# Altium project Whitespace_Daughtercard_r4.PrjPcb (part 1 of 2)
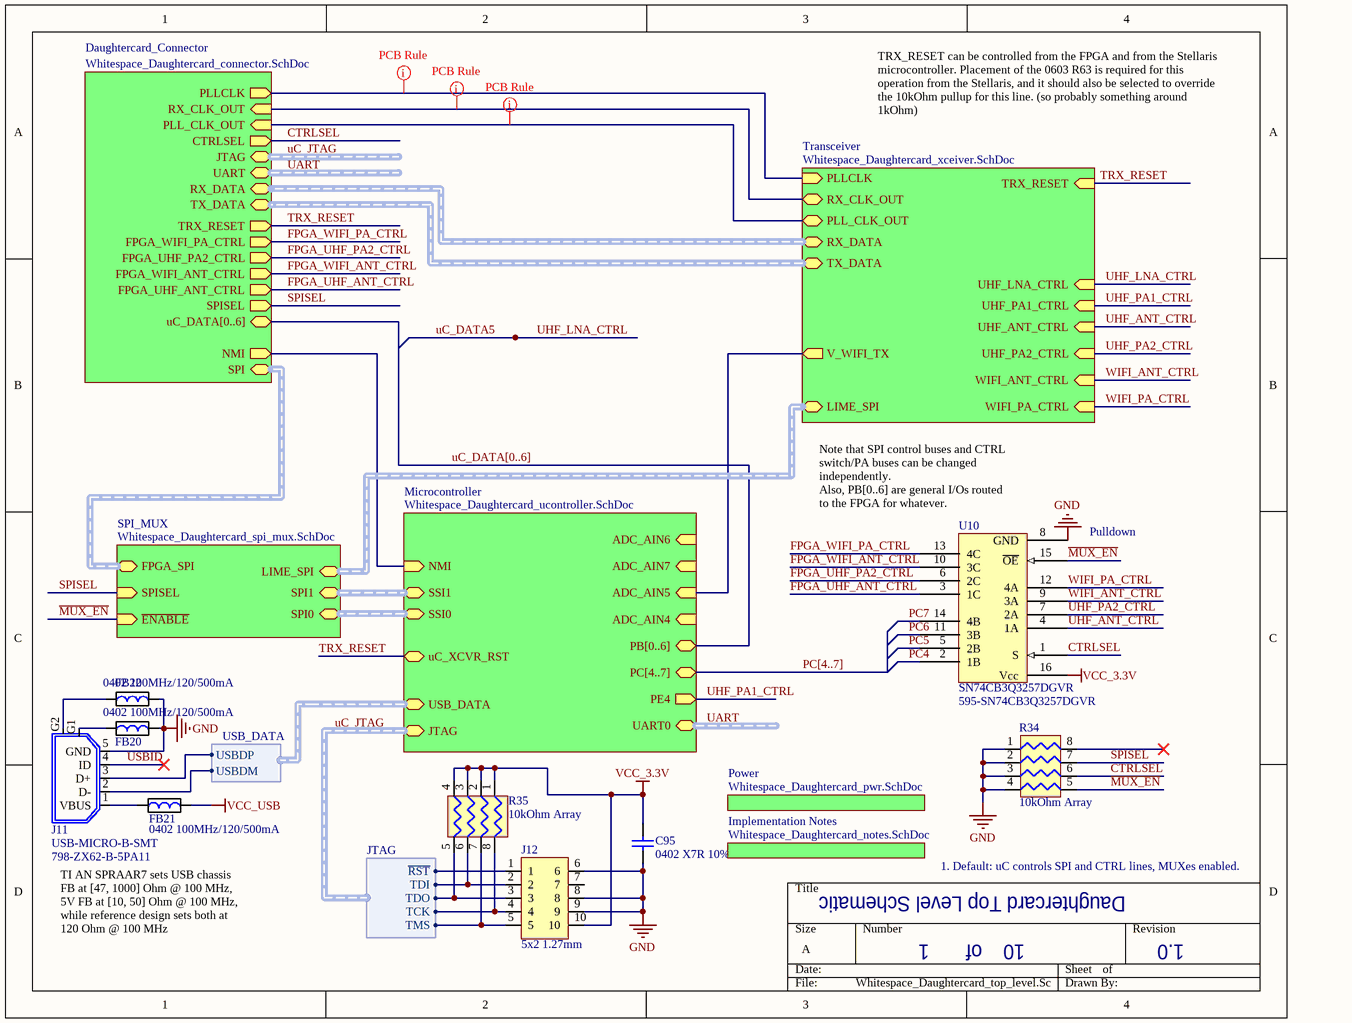
[diagram p0: Whitespace_Daughtercard_top_level.SchDoc]
9 sheets, 355 parts. Net scope: hierarchical (ports join the sheet entries above them; power ports are global).
Board file: Whitespace_Daughtercard.PcbDoc
Sheets:
  Whitespace_Daughtercard_top_level.SchDoc
    Daughtercard_Connector = Whitespace_Daughtercard_connector.SchDoc
    Power = Whitespace_Daughtercard_pwr.SchDoc
    Transceiver = Whitespace_Daughtercard_xceiver.SchDoc
      UHF_RF_FRONT_END = Whitespace_Daughtercard_uhf.SchDoc
      WIFI_RF_FRONT_END = Whitespace_Daughtercard_wifi.SchDoc
    Microcontroller = Whitespace_Daughtercard_ucontroller.SchDoc
    SPI_MUX = Whitespace_Daughtercard_spi_mux.SchDoc
    Implementation Notes = Whitespace_Daughtercard_notes.SchDoc

## Sheet Whitespace_Daughtercard_top_level.SchDoc: Daughtercard Top Level Schematic
size A; Author: Ryan E. Guerra; Revision: 1.0; SheetNumber: 1; SheetTotal: 10

### Parts
C95  0402 X7R 10%  [0402_SMT_V3]
FB20  0402 100MHz/120/500mA  [0402_SMT_v3]
FB21  0402 100MHz/120/500mA  [0402_SMT_v3]
FB22  0402 100MHz/120/500mA  [0402_SMT_v3]
J11  USB-MICRO-B-SMT  Supplier Part Number 1: 798-ZX62-B-5PA11  [USB_MICROB_SMT_R3]
J12  5x2 1.27mm  [1.27mm_2x5_SMT_HDR]
R34  10kOhm Array  [741X083_ChipArray_0402x4_v2]
R35  10kOhm Array  [741X083_ChipArray_0402x4_v2]
U10  SN74CB3Q3257DGVR  Supplier Part Number 1: 595-SN74CB3Q3257DGVR  [TVSOP16_v5]

### Sub-sheets
Daughtercard_Connector = Whitespace_Daughtercard_connector.SchDoc: NMI (out), uC_DATA[0..6], SPISEL (out), FPGA_UHF_ANT_CTRL (out), FPGA_WIFI_ANT_CTRL (out), FPGA_UHF_PA2_CTRL (out), FPGA_WIFI_PA_CTRL (out), SPI (harness SSI), JTAG (harness JTAG), RX_DATA (harness RX_DIG_DATA), TX_DATA (harness TX_DIG_DATA), UART (harness UART), TRX_RESET (out), RX_CLK_OUT (in), PLL_CLK_OUT (in), PLLCLK (out), CTRLSEL (out)
Implementation Notes = Whitespace_Daughtercard_notes.SchDoc: no entries
Microcontroller = Whitespace_Daughtercard_ucontroller.SchDoc: SSI0 (harness SSI), USB_DATA (harness USB_DATA), UART0 (harness UART), NMI (in), JTAG (harness JTAG), PB[0..6], PC[4..7], SSI1 (harness SSI), ADC_AIN6 (in), ADC_AIN7 (in), ADC_AIN5 (in), ADC_AIN4 (in), PE4 (out), uC_XCVR_RST
Power = Whitespace_Daughtercard_pwr.SchDoc: no entries
SPI_MUX = Whitespace_Daughtercard_spi_mux.SchDoc: SPI1 (harness SSI), SPI0 (harness SSI), FPGA_SPI (harness SSI), LIME_SPI (harness SSI), ~{ENABLE} (in), SPISEL (in)
Transceiver = Whitespace_Daughtercard_xceiver.SchDoc: V_WIFI_TX (out), RX_DATA (harness RX_DIG_DATA), TX_DATA (harness TX_DIG_DATA), UHF_ANT_CTRL (in), UHF_PA1_CTRL (in), UHF_PA2_CTRL (in), WIFI_ANT_CTRL (in), WIFI_PA_CTRL (in), TRX_RESET (in), PLLCLK (in), LIME_SPI (harness SSI), RX_CLK_OUT, PLL_CLK_OUT, UHF_LNA_CTRL (in)

### Harnesses
USB_DATA: USBDM, USBDP
JTAG: ~{RST}, TCK, TDI, TDO, TMS

### Nets
GND: C95.2 FB20.2 FB22.2 J11.5(GND) J12.6 J12.8 J12.9 R34.1 R34.2 R34.3 R34.4 U10.8(GND)
VCC_3.3V: C95.1 J12.10 R35.1 R35.2 R35.3 R35.4 U10.16(Vcc)
VCC_USB: FB21.2
~{MUX_EN}: R34.5 U10.15(~{OE}) ; sheet SPI_MUX/~{ENABLE}
~{RST}: J12.1 ; sheet Daughtercard_Connector/JTAG.~{RST}
CTRLSEL: R34.6 U10.1(S) ; sheet Daughtercard_Connector/CTRLSEL
FPGA_UHF_ANT_CTRL: U10.3(1C) ; sheet Daughtercard_Connector/FPGA_UHF_ANT_CTRL
FPGA_UHF_PA2_CTRL: U10.6(2C) ; sheet Daughtercard_Connector/FPGA_UHF_PA2_CTRL
FPGA_WIFI_ANT_CTRL: U10.10(3C) ; sheet Daughtercard_Connector/FPGA_WIFI_ANT_CTRL
FPGA_WIFI_PA_CTRL: U10.13(4C) ; sheet Daughtercard_Connector/FPGA_WIFI_PA_CTRL
NMI: sheet Daughtercard_Connector/NMI, sheet Microcontroller/NMI
PC4: U10.2(1B)
PC5: U10.5(2B)
PC6: U10.11(3B)
PC7: U10.14(4B)
PD2: sheet Transceiver/V_WIFI_TX, sheet Microcontroller/ADC_AIN5
PLL_CLK_OUT: sheet Daughtercard_Connector/PLL_CLK_OUT, sheet Transceiver/PLL_CLK_OUT
PLLCLK: sheet Daughtercard_Connector/PLLCLK, sheet Transceiver/PLLCLK
RX_CLK_OUT: sheet Daughtercard_Connector/RX_CLK_OUT, sheet Transceiver/RX_CLK_OUT
SPISEL: R34.7 ; sheet Daughtercard_Connector/SPISEL, sheet SPI_MUX/SPISEL
TCK: J12.4 R35.8 ; sheet Daughtercard_Connector/JTAG.TCK
TDI: J12.2 R35.6 ; sheet Daughtercard_Connector/JTAG.TDI
TDO: J12.3 R35.5 ; sheet Daughtercard_Connector/JTAG.TDO
TMS: J12.5 R35.7 ; sheet Daughtercard_Connector/JTAG.TMS
TRX_RESET: sheet Daughtercard_Connector/TRX_RESET, sheet Transceiver/TRX_RESET, sheet Microcontroller/uC_XCVR_RST
UHF_ANT_CTRL: U10.4(1A) ; sheet Transceiver/UHF_ANT_CTRL
UHF_PA1_CTRL: sheet Transceiver/UHF_PA1_CTRL, sheet Microcontroller/PE4  [project net PE4]
UHF_PA2_CTRL: U10.7(2A) ; sheet Transceiver/UHF_PA2_CTRL
USB0D_N: J11.2(D-) ; sheet Microcontroller/USB_DATA.USBDM
USB0D_P: J11.3(D+) ; sheet Microcontroller/USB_DATA.USBDP
USBID: J11.4(ID)  [project net USBID_1]
WIFI_ANT_CTRL: U10.9(3A) ; sheet Transceiver/WIFI_ANT_CTRL
WIFI_PA_CTRL: U10.12(4A) ; sheet Transceiver/WIFI_PA_CTRL
NetFB20_1: FB20.1 J11.G1(Chassis_Ground)
NetFB21_1: FB21.1 J11.1(VBUS)
NetFB22_1: FB22.1 J11.G2(Chassis_GND)

Not connected (* = marked no-connect by the designer): J12 7; R34 8*

### Buses and harness runs
bus PC[4..7] = sheet Microcontroller/PC[4..7]
bus uC_DATA[0..6] = sheet Daughtercard_Connector/uC_DATA[0..6] = sheet Microcontroller/PB[0..6]
harness sheet Daughtercard_Connector/RX_DATA = sheet Transceiver/RX_DATA
harness sheet Daughtercard_Connector/SPI = sheet SPI_MUX/FPGA_SPI
harness sheet Daughtercard_Connector/TX_DATA = sheet Transceiver/TX_DATA
harness sheet Microcontroller/SSI0 = sheet SPI_MUX/SPI0
harness sheet Microcontroller/SSI1 = sheet SPI_MUX/SPI1
harness sheet SPI_MUX/LIME_SPI = sheet Transceiver/LIME_SPI
harness UART = sheet Daughtercard_Connector/UART
harness UART = sheet Microcontroller/UART0
harness uC_JTAG = sheet Daughtercard_Connector/JTAG
harness uC_JTAG = sheet Microcontroller/JTAG

### Layout directives
rule Impedance Constraint [Min = 49.00    Max = 51.00    ]: PLL_CLK_OUT, PLLCLK, RX_CLK_OUT

### Notes on the sheet
- TRX_RESET can be controlled from the FPGA and from the Stellaris microcontroller. Placement of the 0603 R63 is required for this operation from the Stellaris, and it should also be selected to override the 10kOhm pullup for this line. (so probably something around 1kOhm)
- (near U10) Note that SPI control buses and CTRL switch/PA buses can be changed independently.
  Also, PB[0..6] are general I/Os routed to the FPGA for whatever.
- Pulldown
- 1. Default: uC controls SPI and CTRL lines, MUXes enabled.
- TI AN SPRAAR7 sets USB chassis FB at [47, 1000] Ohm @ 100 MHz, 5V FB at [10, 50] Ohm @ 100 MHz, while reference design sets both at 120 Ohm @ 100 MHz
- of

### Library data of the parts
C95 = Cap: Capacitor; Value: 0.1uF; Published: 8-Jun-2000; LatestRevisionDate: 17-Jul-2002; LatestRevisionNote: Re-released for DXP Platform.; PackageReference: RAD-0.3; Publisher: Altium Limited; PackageDescription: Radial Cap, Thru-Hole; 2 Leads; 0.3 in Pin Spacing; Supplier 1: Mouser; Supplier Part Number 1: 810-C1005X7R1H104K
FB20-FB22 = FERRITE_BEAD: Ferrite Bead, Various Values; Supplier 1: Mouser; Supplier Part Number 1: 81-BLM15AG121SH1D
  FB20 FB22: Value: 0402 100MHz/120/500mA
J11 = USB-MICRO-B-SMT: Molex Micro-USB Type B Connector; Supplier 1: Mouser
J12 = Header_5x2_FinePitch_1.27mm: 5X2 1.27 SMT Header Pins; Supplier 1: Mouser; Supplier Part Number 1: 649-202112100010C4LF
R34 R35 = 741X083103JP: 10kOhm Ohm 4x0402 Resistor Array; Supplier 1: Mouser; Supplier Part Number 1: 774-741X083103JP
U10 = SN74CB3Q3257DGVR: 4-bit MUX/DEMUX 1-of-2  0-5V SIG 3.3V CTRL TVSOP-16; Supplier 1: Mouser

## Sheet Whitespace_Daughtercard_connector.SchDoc: Daughtercard HSMC Connector & Signals
size A2; Author: Ryan E. Guerra; Revision: 1.0; SheetNumber: 3; SheetTotal: 10
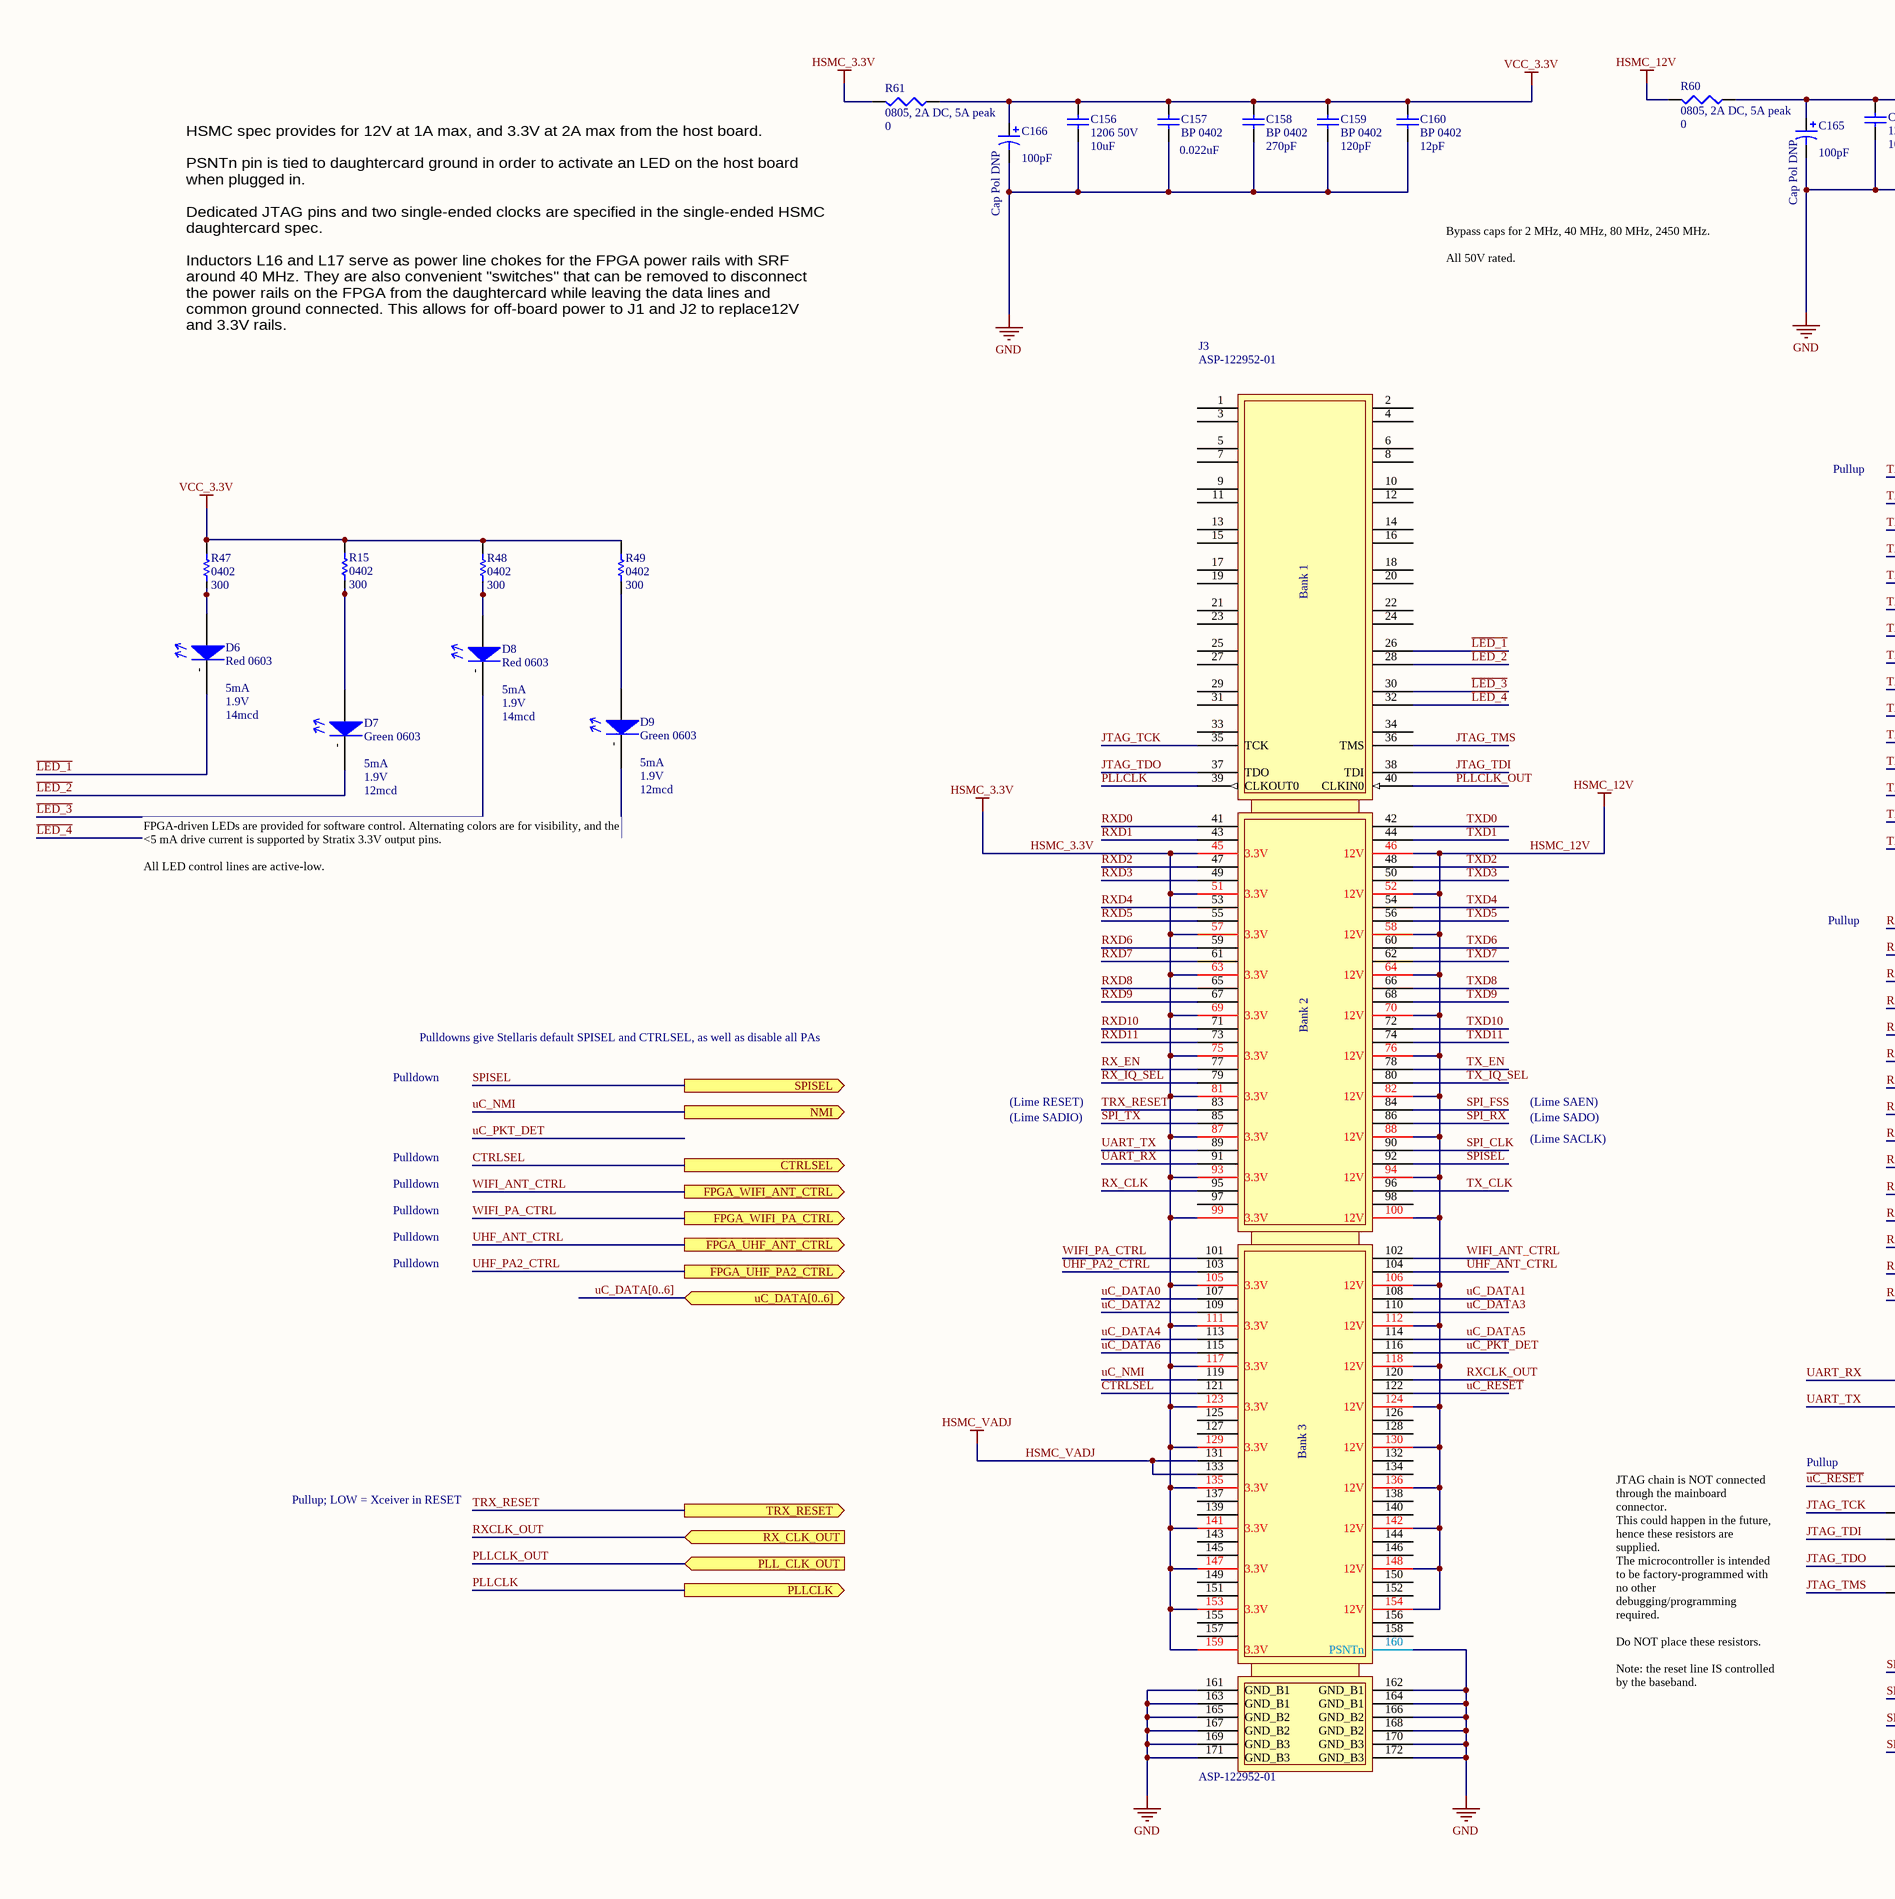
[diagram p1: Whitespace_Daughtercard_connector.SchDoc, left]
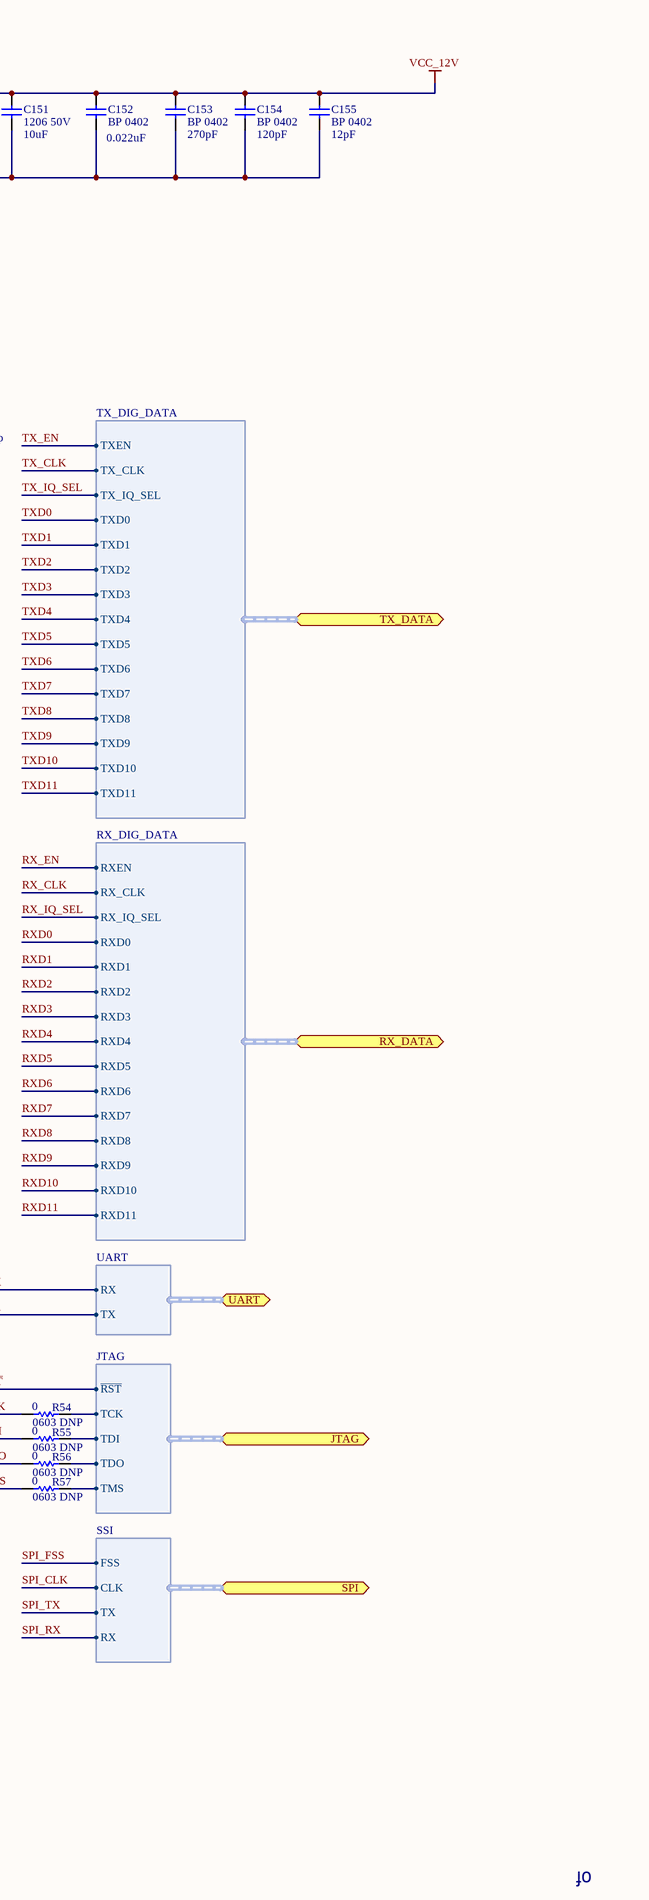
[diagram p2: Whitespace_Daughtercard_connector.SchDoc, right]

### Parts
C151  1206 50V  value 10uF  [1206_SMT_v3]
C152  BP 0402  value 0.022uF  [0402_SMT_V3]
C153  BP 0402  value 270pF  [0402_SMT_v3]
C154  BP 0402  value 120pF  [0402_SMT_v3]
C155  BP 0402  value 12pF  [0402_SMT_v3]
C156  1206 50V  value 10uF  [1206_SMT_v3]
C157  BP 0402  value 0.022uF  [0402_SMT_V3]
C158  BP 0402  value 270pF  [0402_SMT_v3]
C159  BP 0402  value 120pF  [0402_SMT_v3]
C160  BP 0402  value 12pF  [0402_SMT_v3]
C165  Cap Pol DNP  value 100pF  [PANASONIC_ELEC_CAP_G_v2]
C166  Cap Pol DNP  value 100pF  [PANASONIC_ELEC_CAP_G_v2]
D6  Red 0603  Current: 5mA  Forward Voltage Drop: 1.9V  Luminosity: 14mcd  [0603_POLAR]
D7  Green 0603  Current: 5mA  Forward Voltage: 1.9V  Luminosity: 12mcd  [0603_POLAR]
D8  Red 0603  Current: 5mA  Forward Voltage Drop: 1.9V  Luminosity: 14mcd  [0603_POLAR]
D9  Green 0603  Current: 5mA  Forward Voltage: 1.9V  Luminosity: 12mcd  [0603_POLAR]
J3  ASP-122952-01  [ASP-122952-01]
R15  0402  value 300  [0402_SMT_v3]
R47  0402  value 300  [0402_SMT_v3]
R48  0402  value 300  [0402_SMT_v3]
R49  0402  value 300  [0402_SMT_v3]
R54  0603 DNP  value 0  [0603_SMT_v3]
R55  0603 DNP  value 0  [0603_SMT_v3]
R56  0603 DNP  value 0  [0603_SMT_v3]
R57  0603 DNP  value 0  [0603_SMT_v3]
R60  0805, 2A DC, 5A peak  value 0  [0805_SMT_v3]
R61  0805, 2A DC, 5A peak  value 0  [0805_SMT_v3]

### Ports
CTRLSEL (out), FPGA_UHF_ANT_CTRL (out), FPGA_UHF_PA2_CTRL (out), FPGA_WIFI_ANT_CTRL (out), FPGA_WIFI_PA_CTRL (out), JTAG (harness JTAG), NMI (out), PLL_CLK_OUT (in), PLLCLK (out), RX_CLK_OUT (in), RX_DATA (harness RX_DIG_DATA), SPI (harness SSI), SPISEL (out), TRX_RESET (out), TX_DATA (harness TX_DIG_DATA), UART (harness UART), uC_DATA[0..6]

### Harnesses
JTAG: ~{RST}, TCK, TDI, TDO, TMS
RX_DIG_DATA: RXEN, RX_CLK, RX_IQ_SEL, RXD0, RXD1, RXD2, RXD3, RXD4, RXD5, RXD6, RXD7, RXD8, RXD9, RXD10, RXD11
TX_DIG_DATA: TXEN, TX_CLK, TX_IQ_SEL, TXD0, TXD1, TXD2, TXD3, TXD4, TXD5, TXD6, TXD7, TXD8, TXD9, TXD10, TXD11
SSI: FSS, CLK, TX, RX
UART: RX, TX

### Nets
GND: C151.1 C152.1 C153.2 C154.1 C155.2 C156.1 C157.1 C158.2 C159.1 C160.2 C165.2 C166.2 J3.160(PSNTn) J3.161(GND_B1) J3.162(GND_B1) J3.163(GND_B1) J3.164(GND_B1) J3.165(GND_B2) J3.166(GND_B2) J3.167(GND_B2) J3.168(GND_B2) J3.169(GND_B3) J3.170(GND_B3) J3.171(GND_B3) J3.172(GND_B3)
HSMC_3.3V: J3.45(3.3V) J3.51(3.3V) J3.57(3.3V) J3.63(3.3V) J3.69(3.3V) J3.75(3.3V) J3.81(3.3V) J3.87(3.3V) J3.93(3.3V) J3.99(3.3V) J3.105(3.3V) J3.111(3.3V) J3.117(3.3V) J3.123(3.3V) J3.129(3.3V) J3.135(3.3V) J3.141(3.3V) J3.147(3.3V) J3.153(3.3V) J3.159(3.3V) R61.2
HSMC_12V: J3.46(12V) J3.52(12V) J3.58(12V) J3.64(12V) J3.70(12V) J3.76(12V) J3.82(12V) J3.88(12V) J3.94(12V) J3.100(12V) J3.106(12V) J3.112(12V) J3.118(12V) J3.124(12V) J3.130(12V) J3.136(12V) J3.142(12V) J3.148(12V) J3.154(12V) R60.2
HSMC_VADJ: J3.131 J3.133
VCC_3.3V: C156.2 C157.2 C158.1 C159.2 C160.1 C166.1 R15.1 R47.1 R48.1 R49.1 R61.1
VCC_12V: C151.2 C152.2 C153.1 C154.2 C155.1 C165.1 R60.1
~{LED_1}: D6.-(Cathode) J3.26  [project net ~{LED_1_3}]
~{LED_2}: D7.-(Cathode) J3.28  [project net ~{LED_2_3}]
~{LED_3}: D8.-(Cathode) J3.30  [project net ~{LED_3_3}]
~{LED_4}: D9.-(Cathode) J3.32  [project net ~{LED_4_3}]
~{uC_RESET}: J3.122 ; port JTAG.~{RST}  [project net ~{RST}]
CTRLSEL: J3.121 ; port CTRLSEL
JTAG_TCK: J3.35(TCK) R54.2  [project net JTAG_TCK_3]
JTAG_TDI: J3.38(TDI) R55.2  [project net JTAG_TDI_3]
JTAG_TDO: J3.37(TDO) R56.2  [project net JTAG_TDO_3]
JTAG_TMS: J3.36(TMS) R57.2  [project net JTAG_TMS_3]
PLLCLK: J3.39(CLKOUT0) ; port PLLCLK
PLLCLK_OUT: J3.40(CLKIN0) ; port PLL_CLK_OUT  [project net PLL_CLK_OUT]
RX_CLK: J3.95 ; port RX_DATA.RX_CLK
RX_EN: J3.77 ; port RX_DATA.RXEN
RX_IQ_SEL: J3.79 ; port RX_DATA.RX_IQ_SEL
RXCLK_OUT: J3.120 ; port RX_CLK_OUT  [project net RX_CLK_OUT]
RXD0: J3.41 ; port RX_DATA.RXD0
RXD1: J3.43 ; port RX_DATA.RXD1
RXD2: J3.47 ; port RX_DATA.RXD2
RXD3: J3.49 ; port RX_DATA.RXD3
RXD4: J3.53 ; port RX_DATA.RXD4
RXD5: J3.55 ; port RX_DATA.RXD5
RXD6: J3.59 ; port RX_DATA.RXD6
RXD7: J3.61 ; port RX_DATA.RXD7
RXD8: J3.65 ; port RX_DATA.RXD8
RXD9: J3.67 ; port RX_DATA.RXD9
RXD10: J3.71 ; port RX_DATA.RXD10
RXD11: J3.73 ; port RX_DATA.RXD11
SPI_CLK: J3.90 ; port SPI.CLK
SPI_FSS: J3.84 ; port SPI.FSS
SPI_RX: J3.86 ; port SPI.RX
SPI_TX: J3.85 ; port SPI.TX
SPISEL: J3.92 ; port SPISEL
TCK: R54.1 ; port JTAG.TCK
TDI: R55.1 ; port JTAG.TDI
TDO: R56.1 ; port JTAG.TDO
TMS: R57.1 ; port JTAG.TMS
TRX_RESET: J3.83 ; port TRX_RESET
TX_CLK: J3.96 ; port TX_DATA.TX_CLK
TX_EN: J3.78 ; port TX_DATA.TXEN
TX_IQ_SEL: J3.80 ; port TX_DATA.TX_IQ_SEL
TXD0: J3.42 ; port TX_DATA.TXD0
TXD1: J3.44 ; port TX_DATA.TXD1
TXD2: J3.48 ; port TX_DATA.TXD2
TXD3: J3.50 ; port TX_DATA.TXD3
TXD4: J3.54 ; port TX_DATA.TXD4
TXD5: J3.56 ; port TX_DATA.TXD5
TXD6: J3.60 ; port TX_DATA.TXD6
TXD7: J3.62 ; port TX_DATA.TXD7
TXD8: J3.66 ; port TX_DATA.TXD8
TXD9: J3.68 ; port TX_DATA.TXD9
TXD10: J3.72 ; port TX_DATA.TXD10
TXD11: J3.74 ; port TX_DATA.TXD11
UART_RX: J3.91 ; port UART.RX  [project net PA0]
UART_TX: J3.89 ; port UART.TX  [project net PA1]
uC_DATA0: J3.107  [project net PB0]
uC_DATA1: J3.108  [project net PB1]
uC_DATA2: J3.109  [project net PB2]
uC_DATA3: J3.110  [project net PB3]
uC_DATA4: J3.113  [project net PB4]
uC_DATA5: J3.114  [project net PB5]
uC_DATA6: J3.115  [project net PB6]
uC_NMI: J3.119 ; port NMI  [project net NMI]
uC_PKT_DET: J3.116  [project net uC_PKT_DET_3]
UHF_ANT_CTRL: J3.104 ; port FPGA_UHF_ANT_CTRL  [project net FPGA_UHF_ANT_CTRL]
UHF_PA2_CTRL: J3.103 ; port FPGA_UHF_PA2_CTRL  [project net FPGA_UHF_PA2_CTRL]
WIFI_ANT_CTRL: J3.102 ; port FPGA_WIFI_ANT_CTRL  [project net FPGA_WIFI_ANT_CTRL]
WIFI_PA_CTRL: J3.101 ; port FPGA_WIFI_PA_CTRL  [project net FPGA_WIFI_PA_CTRL]
NetD6_+: D6.+(Anode) R47.2
NetD7_+: D7.+(Anode) R15.2
NetD8_+: D8.+(Anode) R48.2
NetD9_+: D9.+(Anode) R49.2

Not connected (* = marked no-connect by the designer): J3 1 2 3 4 5 6 7 8 9 10 11 12 13 14 15 16 17 18 19 20 21 22 23 24 25 27 29 31 33(SDA) 34(SCL) 97 98 125 126 127 128 132 134 137 138 139 140 143 144 145 146 149 150 151 152 155 156 157 158

### Buses and harness runs
bus uC_DATA[0..6] = port uC_DATA[0..6]

### Notes on the sheet
- Bypass caps for 2 MHz, 40 MHz, 80 MHz, 2450 MHz.
  All 50V rated.
- HSMC spec provides for 12V at 1A max, and 3.3V at 2A max from the host board.
  PSNTn pin is tied to daughtercard ground in order to activate an LED on the host board when plugged in.
  Dedicated JTAG pins and two single-ended clocks are specified in the single-ended HSMC daughtercard spec.
  Inductors L16 and L17 serve as power line chokes for the FPGA power rails with SRF around 40 MHz. They are also convenient "switches" that can be removed to disconnect the power rails on the FPGA from the daughtercard while leaving the data lines and common ground connected. This allows for off-board power to J1 and J2 to replace12V and 3.3V rails.
- Pullup
- FPGA-driven LEDs are provided for software control. Alternating colors are for visibility, and the <5 mA drive current is supported by Stratix 3.3V output pins.
  All LED control lines are active-low.
- Pulldowns give Stellaris default SPISEL and CTRLSEL, as well as disable all PAs
- Pulldown
- (Lime RESET)
- (Lime SAEN)
- (Lime SADIO)
- (Lime SADO)
- (Lime SACLK)
- Pullup; LOW = Xceiver in RESET
- JTAG chain is NOT connected through the mainboard connector.
  This could happen in the future, hence these resistors are supplied.
  The microcontroller is intended to be factory-programmed with no other debugging/programming required.
  Do NOT place these resistors.
  Note: the reset line IS controlled by the baseband.
- of
- (in symbol ASP-122952-01) Bank 1; Bank 2; Bank 3

### Library data of the parts
C151-C160 = Cap: Capacitor; Published: 8-Jun-2000; LatestRevisionDate: 17-Jul-2002; LatestRevisionNote: Re-released for DXP Platform.; PackageReference: RAD-0.3; Publisher: Altium Limited; PackageDescription: Radial Cap, Thru-Hole; 2 Leads; 0.3 in Pin Spacing; Supplier 1: Mouser
  C151 C156: Supplier Part Number 1: 81-GRM31CR61H106KA2L
  C152 C157: Supplier Part Number 1: 81-GRM155R71H223KA2J
  C153 C158: Supplier Part Number 1: 81-GRM155C1H271JA01D
  C154 C159: Supplier Part Number 1: 81-GRM1555C1H121GA1D
  C155 C160: Supplier Part Number 1: 81-GRM1555C1H120GA1D
C165 C166 = Cap Pol3: Polarized Capacitor (Surface Mount); Published: 8-Jun-2000; LatestRevisionDate: 29-May-2009; LatestRevisionNote: IPC-7351 Footprint Added.; PackageReference: C0805; Publisher: Altium Limited; PackageDescription: Chip Capacitor; Supplier 1: Mouser; Supplier Part Number 1: 667-EEE-1HA101P
D6-D9 = LED: Supplier 1: Mouser
  D6 D8: Supplier Part Number 1: 859-LTSTC193KRKT5A
  D7 D9: Supplier Part Number 1: 859-LTSTC193KGKT5A
J3 = ASP-122952-01: Samtec HSMC Daughtercard Connector (Male)
R15 R47-R49 R54-R57 = Res Semi: Semiconductor Resistor; Published: 8-Jun-2000; LatestRevisionDate: 17-Jul-2002; LatestRevisionNote: Re-released for DXP Platform.; PackageReference: AXIAL-0.5; Publisher: Altium Limited; PackageDescription: Axial Device, Thru-Hole; 2 Leads; 0.5 in Pin Spacing; Supplier 1: Mouser
  R15 R47-R49: Supplier Part Number 1: 660-RK73B1ETTP301J
  R54-R57: Supplier Part Number 1: 660-RK73Z1JTTDD
R60 R61 = Res3: Resistor; Published: 8-Jun-2000; LatestRevisionDate: 29-May-2009; LatestRevisionNote: IPC-7351 Footprint Added.; PackageReference: J1-0603; Publisher: Altium Limited; PackageDescription: Chip Resistor; Supplier 1: Mouser; Supplier Part Number 1: 660-RK73Z2ATTED

## Sheet Whitespace_Daughtercard_pwr.SchDoc: Daughtercard Power
size A3; DrawnBy: Ryan E. Guerra; Revision: 1.0; SheetNumber: 2; SheetTotal: 10
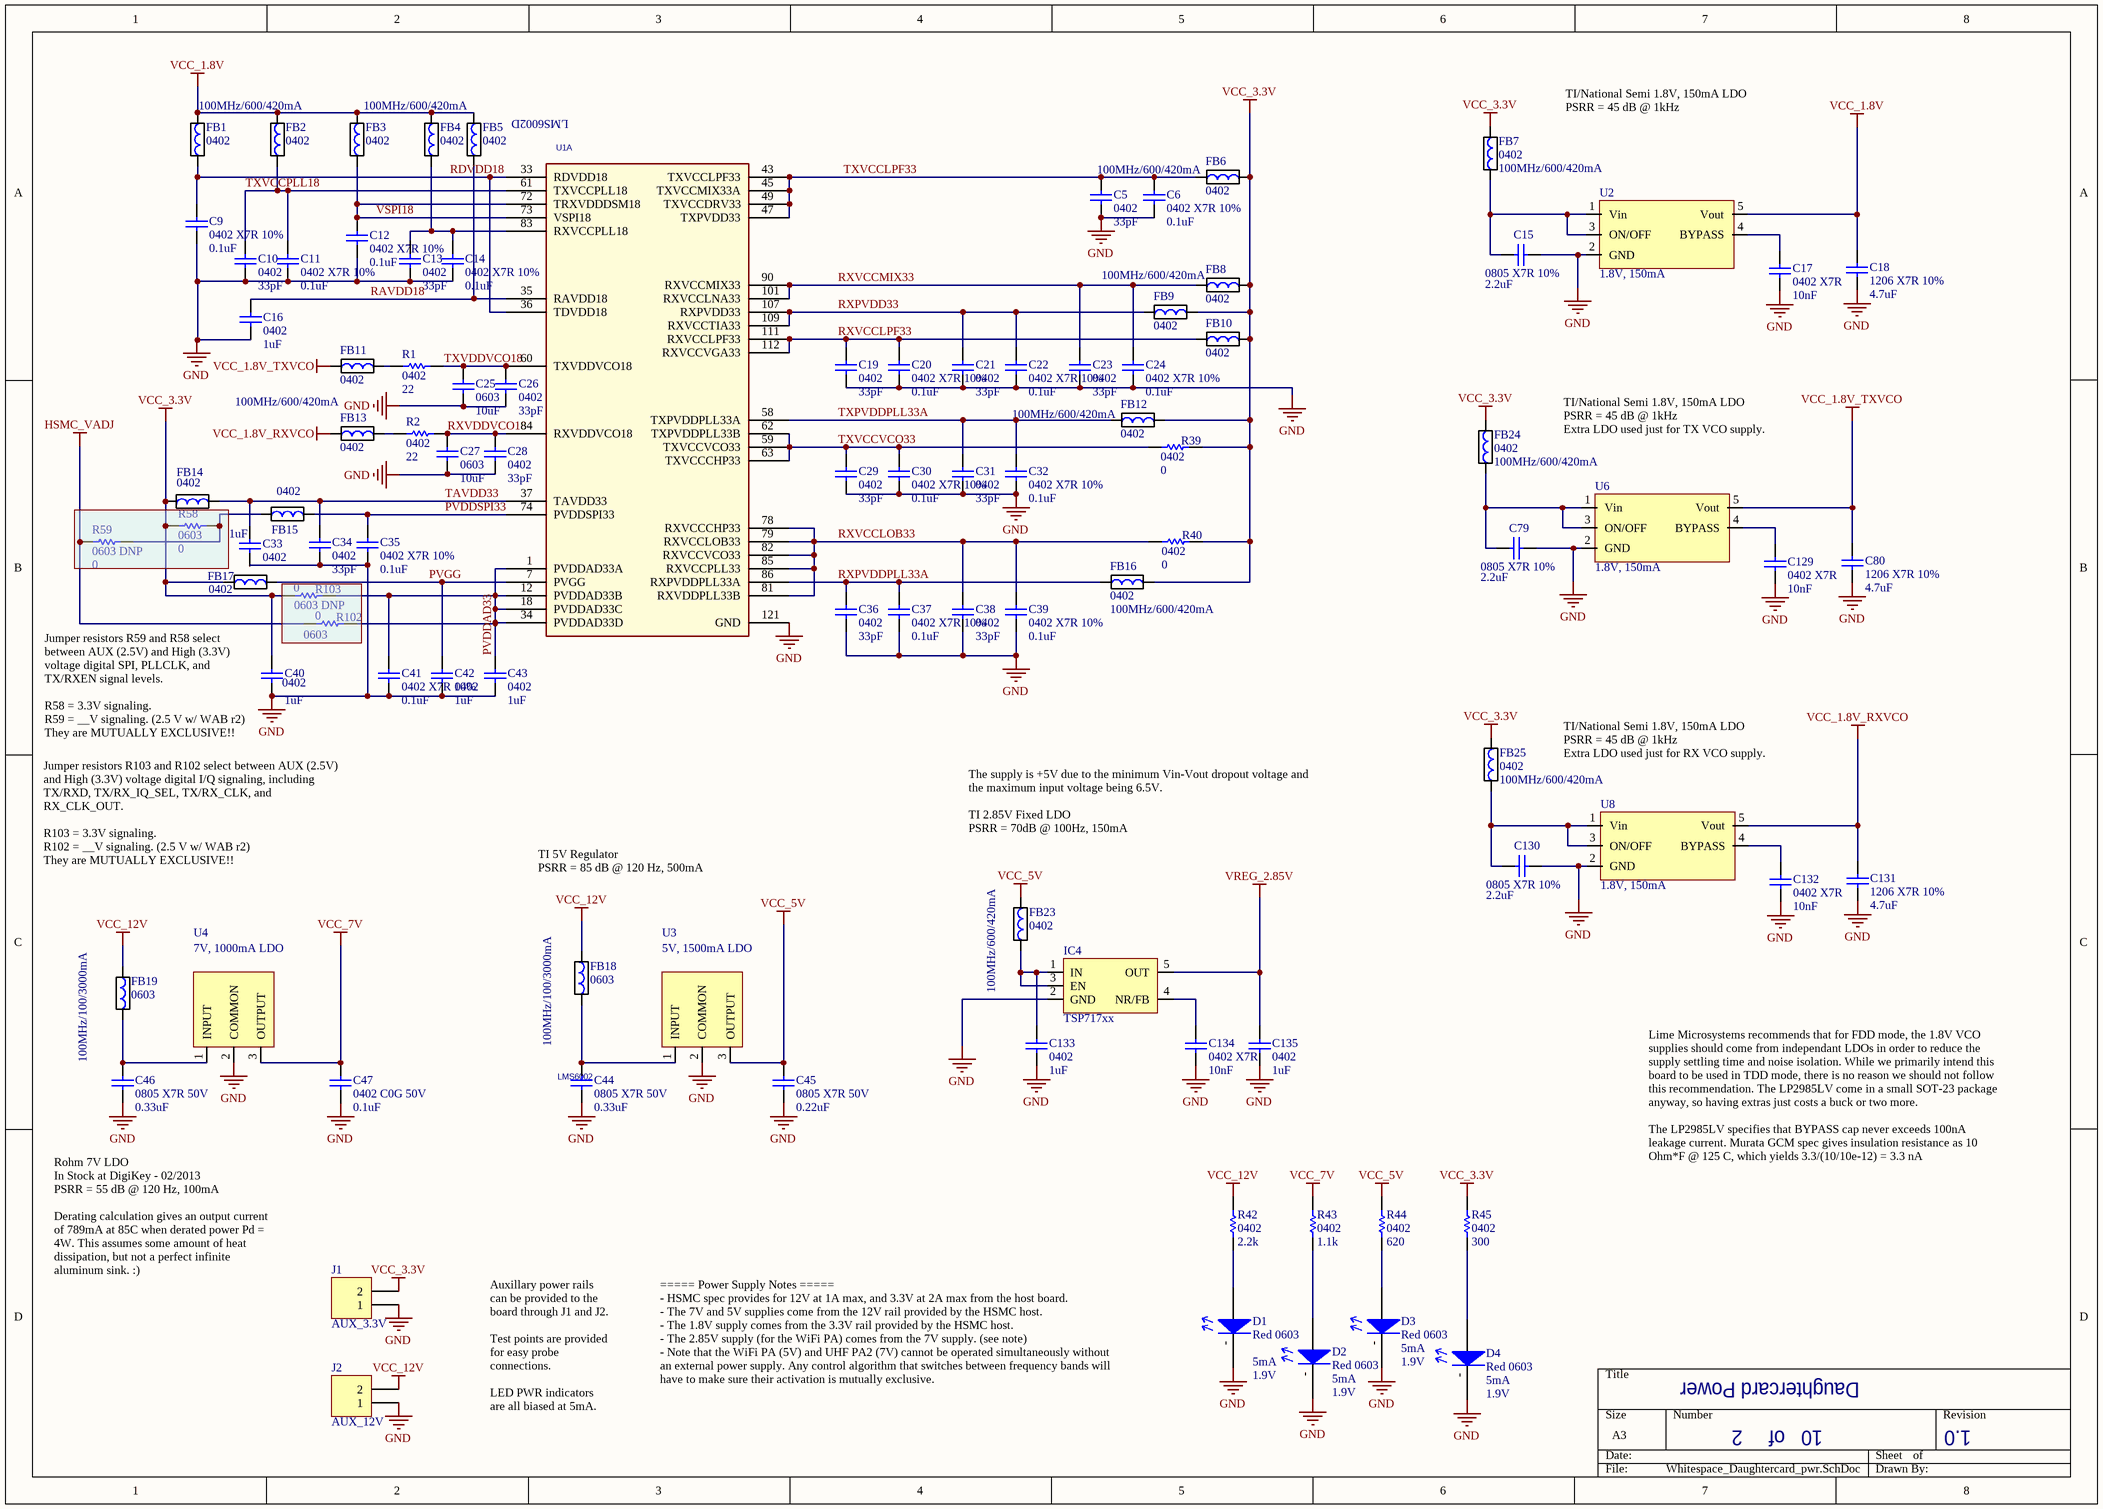
[diagram p3: Whitespace_Daughtercard_pwr.SchDoc]

### Parts
C5  0402  value 33pF  [0402_SMT_v3]
C6  0402 X7R 10%  value 0.1uF  [0402_SMT_v3]
C9  0402 X7R 10%  value 0.1uF  [0402_SMT_v3]
C10  0402  value 33pF  [0402_SMT_v3]
C11  0402 X7R 10%  value 0.1uF  [0402_SMT_v3]
C12  0402 X7R 10%  value 0.1uF  [0402_SMT_v3]
C13  0402  value 33pF  [0402_SMT_v3]
C14  0402 X7R 10%  value 0.1uF  [0402_SMT_v3]
C15  0805 X7R 10%  value 2.2uF  [0805_SMT_v3]
C16  0402  value 1uF  [0402_SMT_v3]
C17  0402 X7R  value 10nF  [0402_SMT_v3]
C18  1206 X7R 10%  value 4.7uF  [1206_SMT_v3]
C19  0402  value 33pF  [0402_SMT_v3]
C20  0402 X7R 10%  value 0.1uF  [0402_SMT_v3]
C21  0402  value 33pF  [0402_SMT_v3]
C22  0402 X7R 10%  value 0.1uF  [0402_SMT_v3]
C23  0402  value 33pF  [0402_SMT_v3]
C24  0402 X7R 10%  value 0.1uF  [0402_SMT_v3]
C25  0603  value 10uF  [0603_SMT_v3]
C26  0402  value 33pF  [0402_SMT_v3]
C27  0603  value 10uF  [0603_SMT_v3]
C28  0402  value 33pF  [0402_SMT_v3]
C29  0402  value 33pF  [0402_SMT_v3]
C30  0402 X7R 10%  value 0.1uF  [0402_SMT_v3]
C31  0402  value 33pF  [0402_SMT_v3]
C32  0402 X7R 10%  value 0.1uF  [0402_SMT_v3]
C33  0402  value 1uF  [0402_SMT_v3]
C34  0402  value 33pF  [0402_SMT_v3]
C35  0402 X7R 10%  value 0.1uF  [0402_SMT_v3]
C36  0402  value 33pF  [0402_SMT_v3]
C37  0402 X7R 10%  value 0.1uF  [0402_SMT_v3]
C38  0402  value 33pF  [0402_SMT_v3]
C39  0402 X7R 10%  value 0.1uF  [0402_SMT_v3]
C40  0402  value 1uF  [0402_SMT_v3]
C41  0402 X7R 10%  value 0.1uF  [0402_SMT_v3]
C42  0402  value 1uF  [0402_SMT_v3]
C43  0402  value 1uF  [0402_SMT_v3]
C44  0805 X7R 50V  value 0.33uF  [0805_SMT_v3]
C45  0805 X7R 50V  value 0.22uF  [0805_SMT_v3]
C46  0805 X7R 50V  value 0.33uF  [0805_SMT_v3]
C47  0402 C0G 50V  value 0.1uF  [0402_SMT_v3]
C79  0805 X7R 10%  value 2.2uF  [0805_SMT_v3]
C80  1206 X7R 10%  value 4.7uF  [1206_SMT_v3]
C129  0402 X7R  value 10nF  [0402_SMT_v3]
C130  0805 X7R 10%  value 2.2uF  [0805_SMT_v3]
C131  1206 X7R 10%  value 4.7uF  [1206_SMT_v3]
C132  0402 X7R  value 10nF  [0402_SMT_v3]
C133  0402  value 1uF  [0402_SMT_v3]
C134  0402 X7R  value 10nF  [0402_SMT_v3]
C135  0402  value 1uF  [0402_SMT_v3]
D1  Red 0603  Current: 5mA  Forward Voltage Drop: 1.9V  [0603_POLAR]
D2  Red 0603  Current: 5mA  Forward Voltage Drop: 1.9V  [0603_POLAR]
D3  Red 0603  Current: 5mA  Forward Voltage Drop: 1.9V  [0603_POLAR]
D4  Red 0603  Current: 5mA  Forward Voltage Drop: 1.9V  [0603_POLAR]
FB1  0402  value 100MHz/600/420mA  [0402_SMT_v3]
FB2  0402  [0402_SMT_v3]
FB3  0402  [0402_SMT_v3]
FB4  0402  [0402_SMT_v3]
FB5  0402  value 100MHz/600/420mA  [0402_SMT_v3]
FB6  0402  value 100MHz/600/420mA  [0402_SMT_v3]
FB7  0402  value 100MHz/600/420mA  [0402_SMT_v3]
FB8  0402  [0402_SMT_v3]
FB9  0402  value 100MHz/600/420mA  [0402_SMT_v3]
FB10  0402  [0402_SMT_v3]
FB11  0402  [0402_SMT_v3]
FB12  0402  value 100MHz/600/420mA  [0402_SMT_v3]
FB13  0402  value 100MHz/600/420mA  [0402_SMT_v3]
FB14  0402  [0402_SMT_v3]
FB15  0402  [0402_SMT_v3]
FB16  0402  value 100MHz/600/420mA  [0402_SMT_v3]
FB17  0402  [0402_SMT_v3]
FB18  0603  value 100MHz/100/3000mA  [0603_SMT_v3]
FB19  0603  value 100MHz/100/3000mA  [0603_SMT_v3]
FB23  0402  value 100MHz/600/420mA  [0402_SMT_v3]
FB24  0402  value 100MHz/600/420mA  [0402_SMT_v3]
FB25  0402  value 100MHz/600/420mA  [0402_SMT_v3]
IC4  TSP717xx  [SC70-5]
J1  AUX_3.3V  [HDR1X2]
J2  AUX_12V  [HDR1X2]
R1  0402  value 22  [0402_SMT_v3]
R2  0402  value 22  [0402_SMT_v3]
R39  0402  value 0  [0402_SMT_v3]
R40  0402  value 0  [0402_SMT_v3]
R42  0402  value 2.2k  [0402_SMT_v3]
R43  0402  value 1.1k  [0402_SMT_v3]
R44  0402  value 620  [0402_SMT_v3]
R45  0402  value 300  [0402_SMT_v3]
R58  0603  value 0  [0603_SMT_v3]
R59  0603 DNP  value 0  [0603_SMT_v3]
R102  0603  value 0  [0603_SMT_v3]
R103  0603 DNP  value 0  [0603_SMT_v3]
U1  LMS6002  [LMS6002D_VIAOFFPAD_v2_Window]  (part A of 4)
U2  1.8V, 150mA  [SOT-23_5Lead]
U3  5V, 1500mA LDO  [TO-263]
U4  7V, 1000mA LDO  [TO252-3]
U6  1.8V, 150mA  [SOT-23_5Lead]
U8  1.8V, 150mA  [SOT-23_5Lead]

### Nets
GND: C5.2 C6.1 C9.1 C10.1 C11.1 C12.1 C13.2 C14.1 C15.1 C16.2 C17.1 C18.1 C19.2 C20.1 C21.2 C22.1 C23.2 C24.1 C25.1 C26.2 C27.1 C28.2 C29.2 C30.1 C31.2 C32.1 C34.1 C35.2 C36.2 C37.1 C38.2 C39.1 C40.1 C41.1 C42.1 C43.1 C44.2 C45.2 C46.2 C47.1 C79.1 C80.1 C129.1 C130.1 C131.1 C132.1 C133.1 C134.1 C135.1 D1.-(Cathode) D2.-(Cathode) D3.-(Cathode) D4.-(Cathode) IC4.2(GND) J1.1 J2.1 U1.121(GND) U2.2(GND) U3.2(COMMON) U4.2(COMMON) U6.2(GND) U8.2(GND)
HSMC_VADJ: R59.1 R102.2
VCC_1.8V: C18.2 FB1.2 FB2.2 FB3.2 FB4.2 FB5.2 U2.5(Vout)
VCC_1.8V_RXVCO: C131.2 FB13.1 U8.5(Vout)
VCC_1.8V_TXVCO: C80.2 FB11.1 U6.5(Vout)
VCC_3.3V: C40.2 FB6.2 FB7.2 FB8.2 FB9.2 FB10.2 FB12.2 FB14.1 FB16.2 FB17.1 FB24.2 FB25.2 J1.2 R39.1 R40.1 R45.2 R58.1 R103.2
VCC_5V: C45.1 FB23.2 R44.2 U3.3(OUTPUT)
VCC_7V: C47.2 R43.2 U4.3(OUTPUT)
VCC_12V: FB18.1 FB19.1 J2.2 R42.2
VREG_2.85V: C135.2 IC4.5(OUT)
PVDDAD33: C41.2 C43.2 R102.1 R103.1 U1.1(PVDDAD33A) U1.12(PVDDAD33B) U1.18(PVDDAD33C) U1.34(PVDDAD33D)  [project net PVDDAD33_2]
PVDDSPI33: C35.1 FB15.2 U1.74(PVDDSPI33)  [project net PVDDSPI33_2]
PVGG: C42.2 FB17.2 U1.7(PVGG)  [project net PVGG_2]
RAVDD18: C16.1 FB5.1 U1.35(RAVDD18)  [project net RAVDD18_2]
RDVDD18: C9.2 FB1.1 U1.33(RDVDD18) U1.36(TDVDD18)  [project net RDVDD18_2]
RXPVDD33: C21.1 C22.2 FB9.1 U1.107(RXPVDD33) U1.109(RXVCCTIA33)  [project net RXPVDD33_2]
RXPVDDPLL33A: C36.1 C37.2 FB16.1 U1.86(RXPVDDPLL33A)  [project net RXPVDDPLL33A_2]
RXVCCLOB33: C38.1 C39.2 R40.2 U1.78(RXVCCCHP33) U1.79(RXVCCLOB33) U1.81(RXVDDPLL33B) U1.82(RXVCCVCO33) U1.85(RXVCCPLL33)  [project net RXVCCLOB33_2]
RXVCCLPF33: C19.1 C20.2 FB10.1 U1.111(RXVCCLPF33) U1.112(RXVCCVGA33)  [project net RXVCCLPF33_2]
RXVCCMIX33: C23.1 C24.2 FB8.1 U1.90(RXVCCMIX33) U1.101(RXVCCLNA33)  [project net RXVCCMIX33_2]
RXVDDVCO18: C27.2 C28.1 R2.1 U1.84(RXVDDVCO18)  [project net RXVDDVCO18_2]
TAVDD33: C33.2 C34.2 FB14.2 U1.37(TAVDD33)  [project net TAVDD33_2]
TXPVDDPLL33A: C31.1 C32.2 FB12.1 U1.58(TXPVDDPLL33A)  [project net TXPVDDPLL33A_2]
TXVCCLPF33: C5.1 C6.2 FB6.1 U1.43(TXVCCLPF33) U1.45(TXVCCMIX33A) U1.47(TXPVDD33) U1.49(TXVCCDRV33)  [project net TXVCCLPF33_2]
TXVCCPLL18: C10.2 C11.2 FB2.1 U1.61(TXVCCPLL18)  [project net TXVCCPLL18_2]
TXVCCVCO33: C29.1 C30.2 R39.2 U1.59(TXVCCVCO33) U1.62(TXPVDDPLL33B) U1.63(TXVCCCHP33)  [project net TXVCCVCO33_2]
TXVDDVCO18: C25.2 C26.1 R1.1 U1.60(TXVDDVCO18)  [project net TXVDDVCO18_2]
VSPI18: C12.2 FB3.1 U1.72(TRXVDDDSM18) U1.73(VSPI18)  [project net VSPI18_2]
NetC13_1: C13.1 C14.2 FB4.1 U1.83(RXVCCPLL18)
NetC15_2: C15.2 FB7.1 U2.1(Vin) U2.3(ON/OFF)
NetC17_2: C17.2 U2.4(BYPASS)
NetC44_1: C44.1 FB18.2 U3.1(INPUT)
NetC46_1: C46.1 FB19.2 U4.1(INPUT)
NetC79_2: C79.2 FB24.1 U6.1(Vin) U6.3(ON/OFF)
NetC129_2: C129.2 U6.4(BYPASS)
NetC130_2: C130.2 FB25.1 U8.1(Vin) U8.3(ON/OFF)
NetC132_2: C132.2 U8.4(BYPASS)
NetC133_2: C133.2 FB23.1 IC4.1(IN) IC4.3(EN)
NetC134_2: C134.2 IC4.4(NR/FB)
NetD1_+: D1.+(Anode) R42.1
NetD2_+: D2.+(Anode) R43.1
NetD3_+: D3.+(Anode) R44.1
NetD4_+: D4.+(Anode) R45.1
NetFB11_2: FB11.2 R1.2
NetFB13_2: FB13.2 R2.2
NetFB15_1: FB15.1 R58.2 R59.2

Not connected (* = marked no-connect by the designer): C33 1

### Notes on the sheet
- TI/National Semi 1.8V, 150mA LDO
  PSRR = 45 dB @ 1kHz
- TI/National Semi 1.8V, 150mA LDO
  PSRR = 45 dB @ 1kHz
  Extra LDO used just for TX VCO supply.
- (near C40) Jumper resistors R59 and R58 select between AUX (2.5V) and High (3.3V) voltage digital SPI, PLLCLK, and TX/RXEN signal levels.
  R58 = 3.3V signaling.
  R59 = __V signaling. (2.5 V w/ WAB r2)
  They are MUTUALLY EXCLUSIVE!!
- TI/National Semi 1.8V, 150mA LDO
  PSRR = 45 dB @ 1kHz
  Extra LDO used just for RX VCO supply.
- (near FB23) The supply is +5V due to the minimum Vin-Vout dropout voltage and the maximum input voltage being 6.5V.
  TI 2.85V Fixed LDO
  PSRR = 70dB @ 100Hz, 150mA
- Jumper resistors R103 and R102 select between AUX (2.5V) and High (3.3V) voltage digital I/Q signaling, including TX/RXD, TX/RX_IQ_SEL, TX/RX_CLK, and RX_CLK_OUT.
  R103 = 3.3V signaling.
  R102 = __V signaling. (2.5 V w/ WAB r2)
  They are MUTUALLY EXCLUSIVE!!
- TI 5V Regulator
  PSRR = 85 dB @ 120 Hz, 500mA
- Lime Microsystems recommends that for FDD mode, the 1.8V VCO supplies should come from independant LDOs in order to reduce the supply settling time and noise isolation. While we primarily intend this board to be used in TDD mode, there is no reason we should not follow this recommendation. The LP2985LV come in a small SOT-23 package anyway, so having extras just costs a buck or two more.
  The LP2985LV specifies that BYPASS cap never exceeds 100nA leakage current. Murata GCM spec gives insulation resistance as 10 Ohm*F @ 125 C, which yields 3.3/(10/10e-12) = 3.3 nA
- Rohm 7V LDO
  In Stock at DigiKey - 02/2013
  PSRR = 55 dB @ 120 Hz, 100mA
  Derating calculation gives an output current of 789mA at 85C when derated power Pd = 4W. This assumes some amount of heat dissipation, but not a perfect infinite aluminum sink. :)
- Auxillary power rails can be provided to the board through J1 and J2.
  Test points are provided for easy probe connections.
  LED PWR indicators are all biased at 5mA.
- of
- (in symbol LMS6002, part A) LMS6002D

### Library data of the parts
C5 C6 C9-C47 C79 C80 C129-C135 = Cap Semi: Capacitor (Semiconductor SIM Model); Published: 8-Jun-2000; LatestRevisionDate: 29-May-2009; LatestRevisionNote: IPC-7351 Footprint Added.; PackageReference: C1206; Publisher: Altium Limited; PackageDescription: Chip Capacitor
  C5 C10 C13 C19 C21 C23 C26 C28 C29 C31 C34 C36 C38: Supplier 1: Mouser; Supplier Part Number 1: 81-GRM1555C1H330JA1D
  C6 C9 C11 C12 C14 C20 C22 C24 C30 C32 C35 C37 C39 C41: Supplier 1: Mouser; Supplier Part Number 1: 810-C1005X7R1H104K
  C15 C79 C130: Supplier 1: Mouser; Supplier Part Number 1: 963-UMK212BB7225KG-T
  C16 C33 C40 C42 C43 C133 C135: Supplier 1: Mouser; Supplier Part Number 1: 810-C1005X5R1E105K
  C17 C129 C132 C134: Supplier 1: Mouser; Supplier Part Number 1: 81-GCM155R71H103KA5D
  C18 C80 C131: Supplier 1: Mouser; Supplier Part Number 1: 963-UMK316AB7475KL-T
  C25 C27: Supplier 1: Mouser; Supplier Part Number 1: 963-EMK107BBJ106MA-T
  C44 C46: Supplier 1: Mouser; Supplier Part Number 1: 81-GRM219R71H334KA88
  C45: Supplier 1: Mouser; Supplier Part Number 1: 81-GRM40X7R224K050AL
  C47: Supplier 1: TDK; Supplier Part Number 1: 810-C1005X7R1H104K
D1-D4 = LED: Supplier 1: Mouser; Supplier Part Number 1: 859-LTSTC193KRKT5A
FB1 FB5-FB7 FB9 FB12 FB13 FB16 FB18 FB19 FB23-FB25 = FERRITE_BEAD: Ferrite Bead, Various Values; Supplier 1: Mouser
  FB1 FB5-FB7 FB9 FB12 FB13 FB16 FB23-FB25: Supplier Part Number 1: 81-BLM15AX601SN1D
  FB18 FB19: Pricing: 1=0.340, 50=0.120, 100=0.066, 500=0.047, 1000=0.035, 4000=0.025, 8000=0.023, 12000=0.022, 20000=0.019 (USD); Supplier Part Number 1: 81-BLM18KG101TN1D
FB2-FB4 FB8 FB10 FB11 FB14 FB15 FB17 = FERRITE_BEAD: Ferrite Bead, Various Values; Value: 100MHz/600/420mA; Supplier 1: Mouser; Supplier Part Number 1: 81-BLM15AX601SN1D
IC4 = TSP717xx: TI LDO Regulator SC70-5 0.9-6.2V; Supplier 1: Mouser; Supplier Part Number 1: 595-TPS717285DCKR
J1 J2 = Header 2: Header, 2-Pin; LatestRevisionDate: 17-Jul-2002; LatestRevisionNote: Re-released for DXP Platform.; Publisher: Altium Limited
R1 R2 R39 R40 R42-R45 R58 R59 R102 R103 = Res Semi: Semiconductor Resistor; Published: 8-Jun-2000; LatestRevisionDate: 17-Jul-2002; LatestRevisionNote: Re-released for DXP Platform.; PackageReference: AXIAL-0.5; Publisher: Altium Limited; PackageDescription: Axial Device, Thru-Hole; 2 Leads; 0.5 in Pin Spacing; Supplier 1: Mouser
  R1 R2: Supplier Part Number 1: 667-ERJ-2GEJ220X
  R39 R40: Supplier Part Number 1: 660-RK73Z1ETTP
  R42: Supplier Part Number 1: 660-RK73B1ETTP222J
  R43: Supplier Part Number 1: 660-RK73B1ETTP112J
  R44: Supplier Part Number 1: 660-RK73B1ETTP621J
  R45: Supplier Part Number 1: 660-RK73B1ETTP301J
  R58 R59 R102 R103: Supplier Part Number 1: 660-RK73Z1JTTDD
U1 = LMS6002: Lime Microsystems Wideband Transceiver Module
U2 U6 U8 = LP2985IM5-1.8: TO LDO 1.8V 150mA Regulator w/ ON/OFF; Supplier 1: Mouser; Supplier Part Number 1: 926-2985IM5-1.8/NOPB
U3 = TL780-05CKTTRG3: TI 5V, 1500mA LDO; Supplier 1: Mouser; Supplier Part Number 1: 595-TL780-05CKTTR
U4 = BA7807FP: ROHM 7V, 1000mA LDO; Supplier 1: Digi-Key; Supplier Part Number 1: BA7807FP-E2DKR-ND

## Sheet Whitespace_Daughtercard_xceiver.SchDoc: RF Transceiver Top Level Design & Signals
size A2; Author: Ryan E. Guerra; Revision: 1.0; SheetNumber: 4; SheetTotal: 10
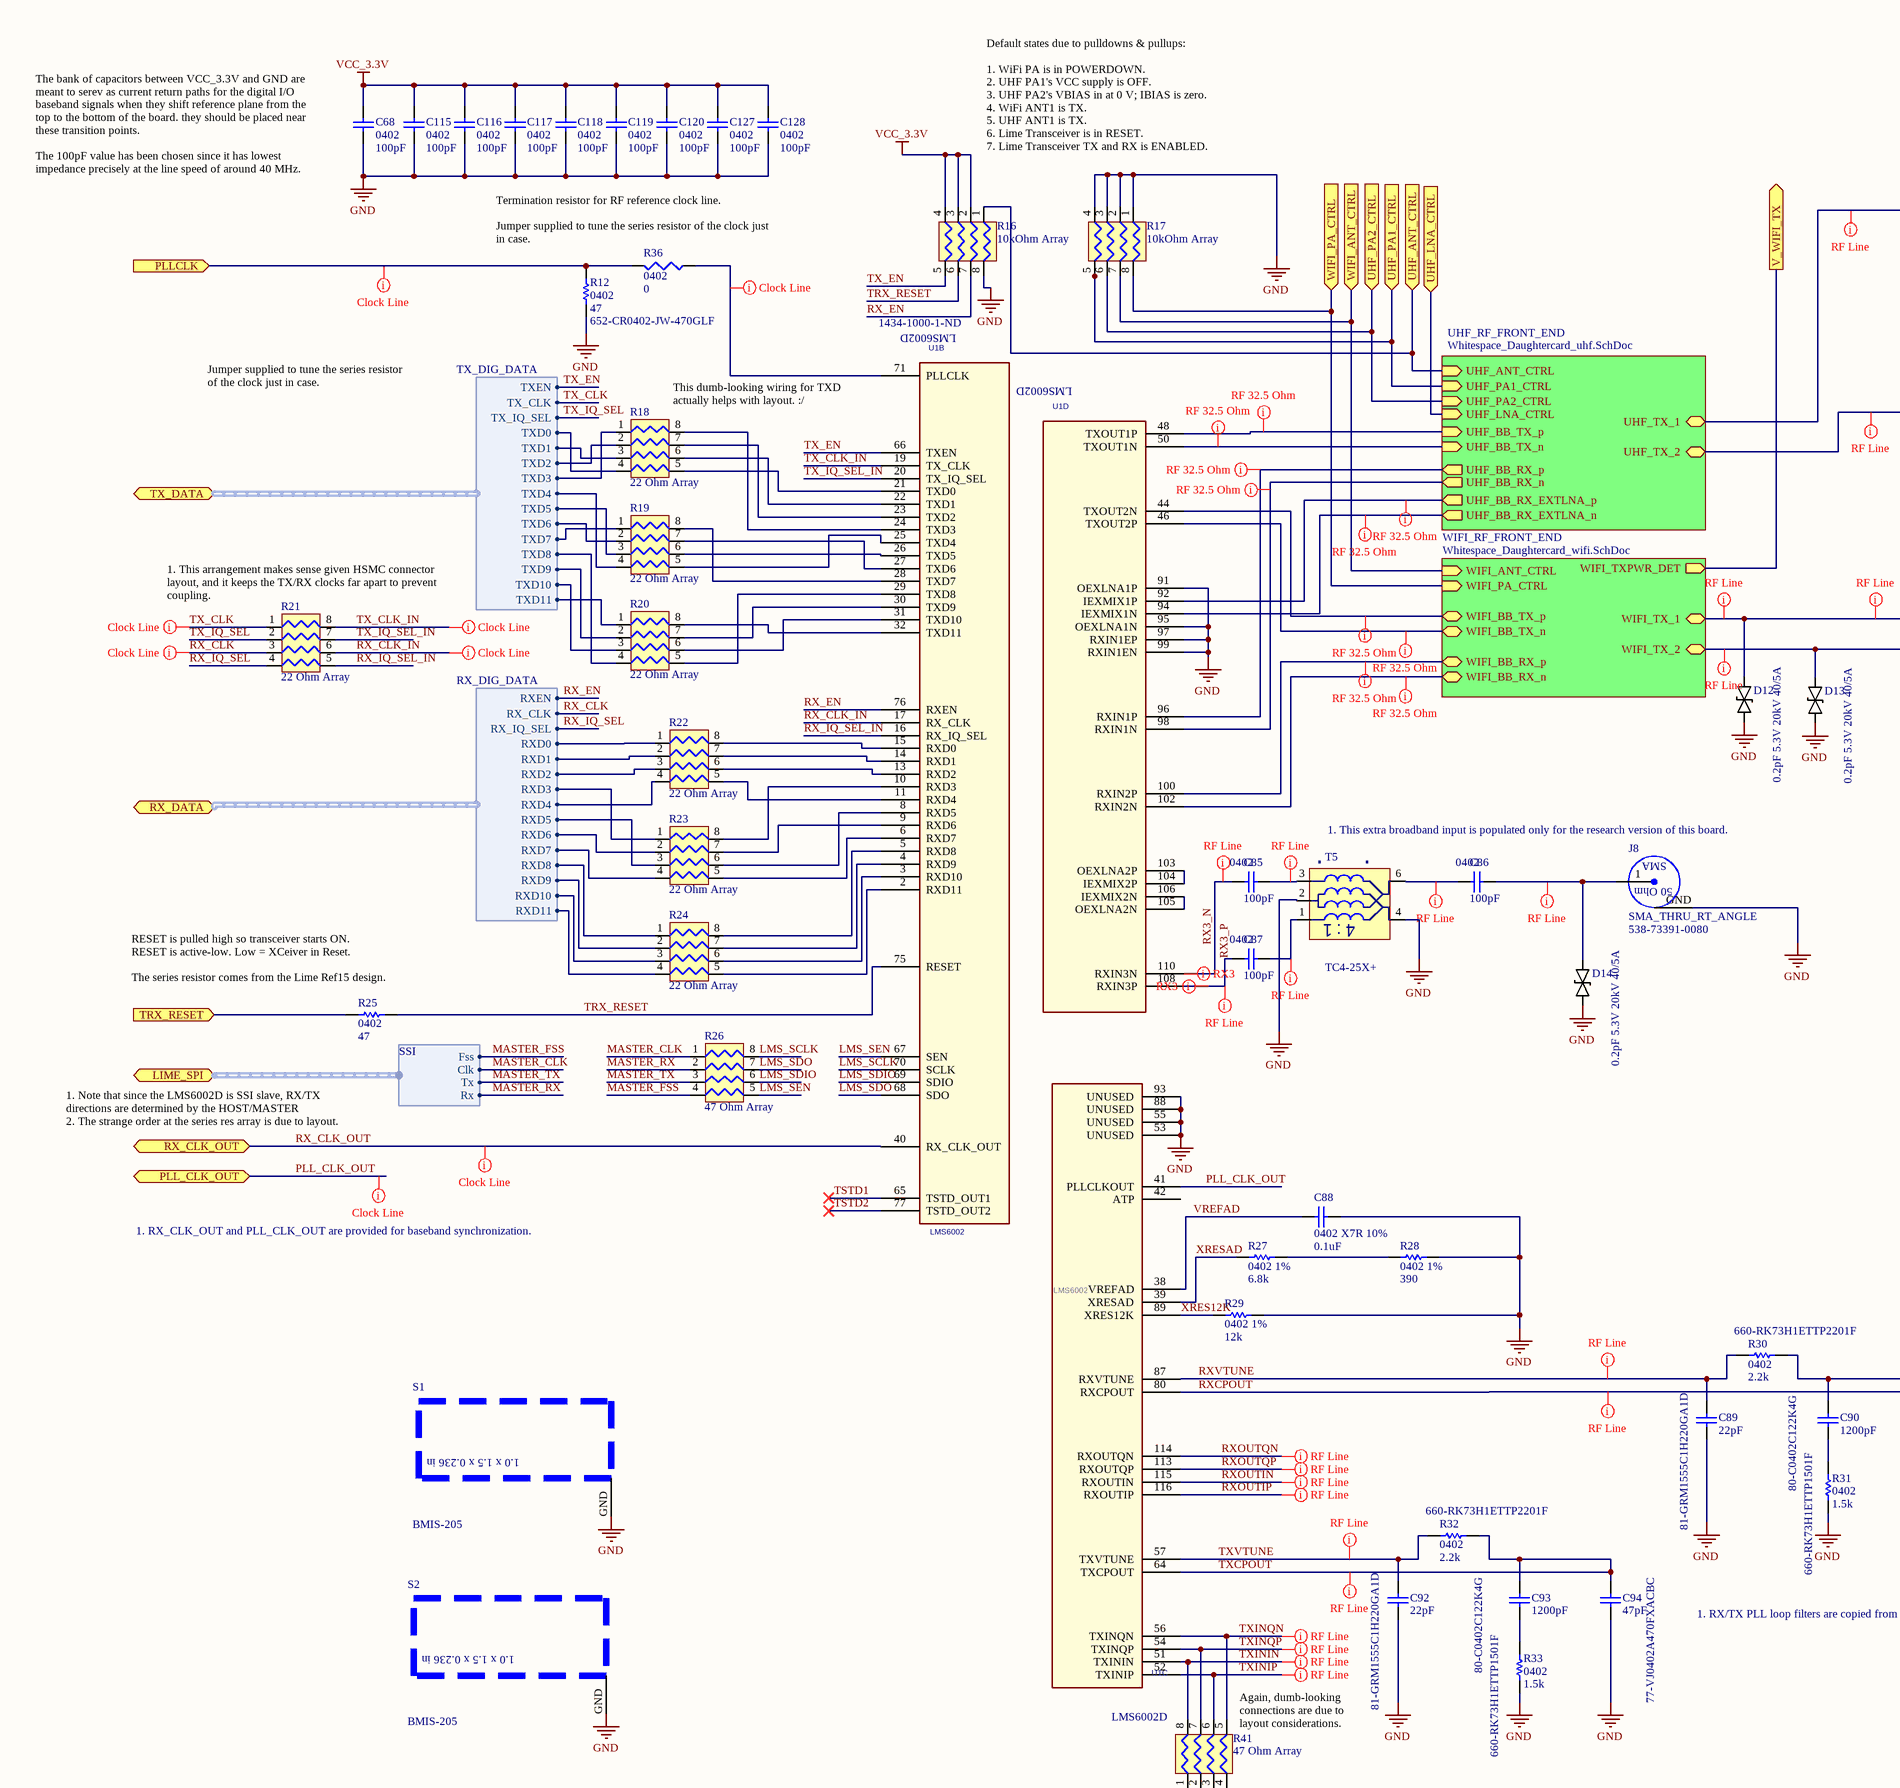
[diagram p4: Whitespace_Daughtercard_xceiver.SchDoc, top left]
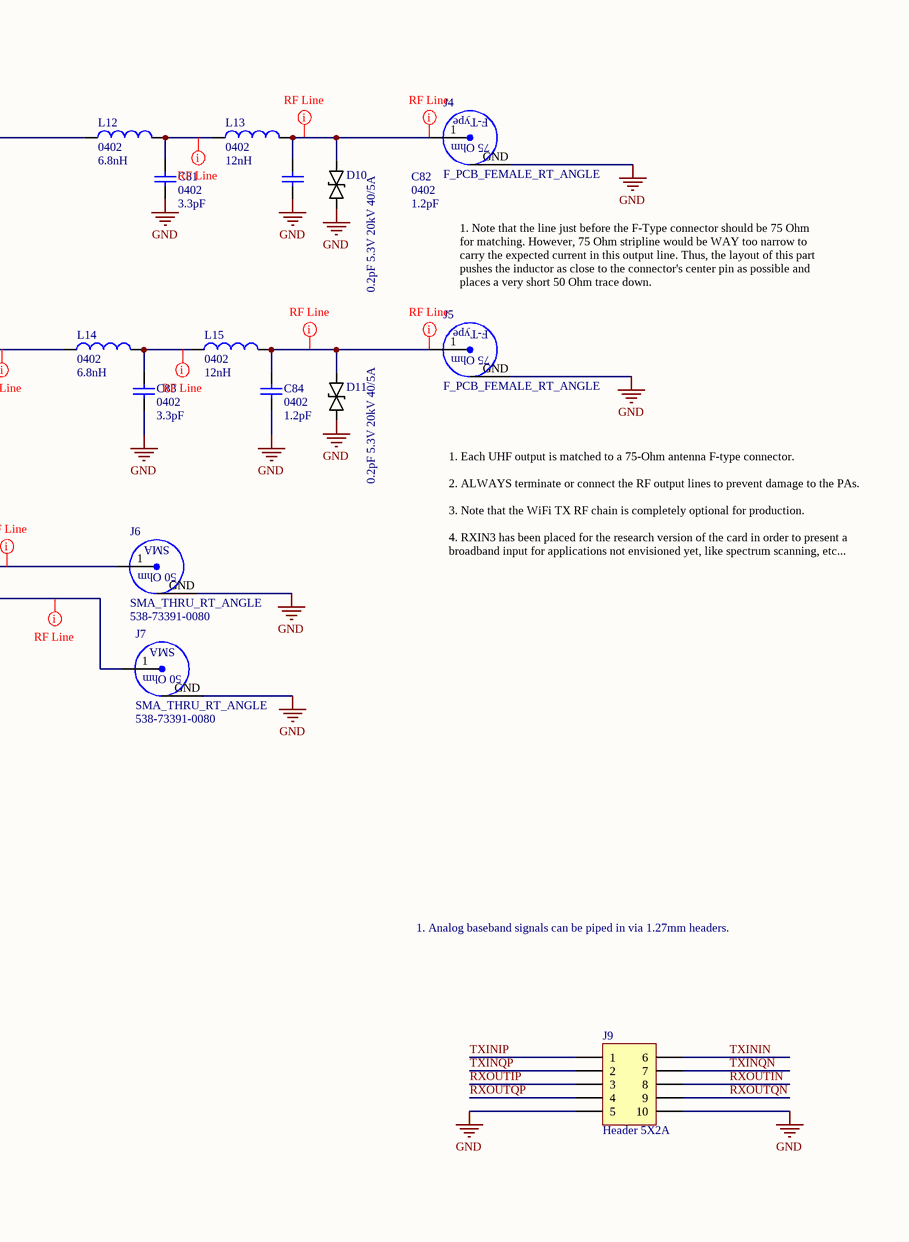
[diagram p5: Whitespace_Daughtercard_xceiver.SchDoc, top right]
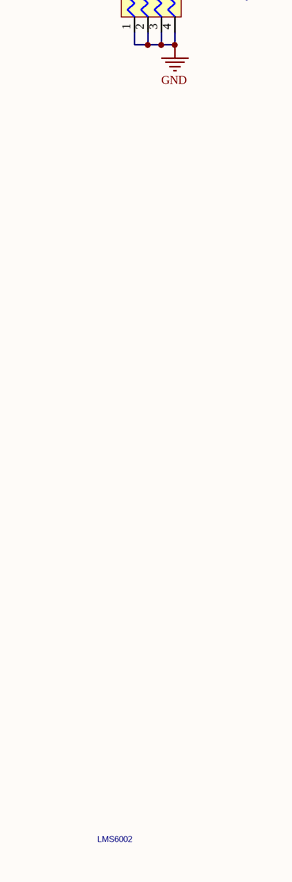
[diagram p6: Whitespace_Daughtercard_xceiver.SchDoc, bottom left]
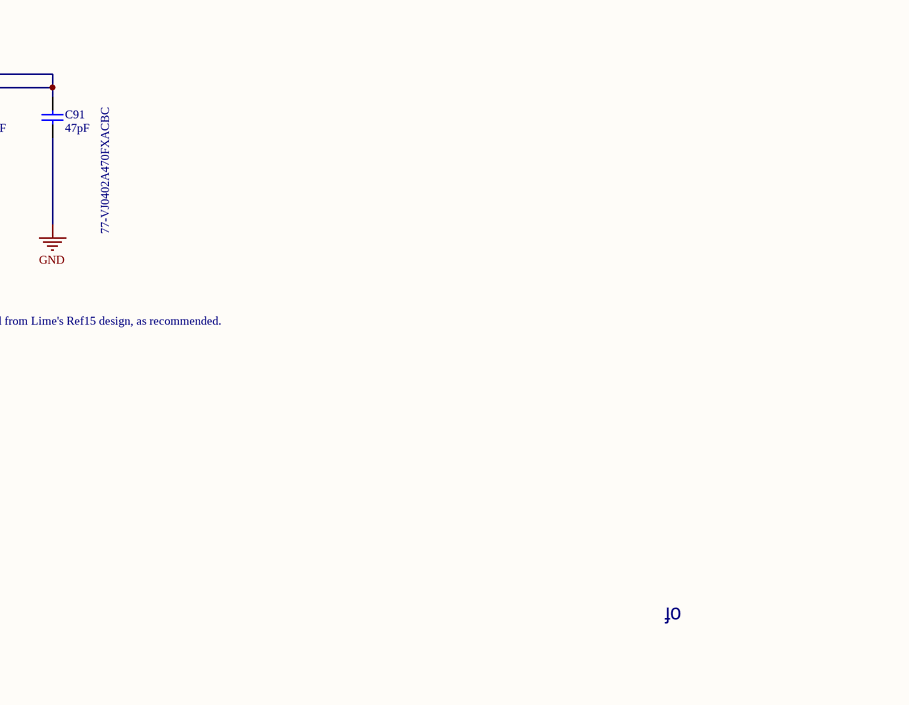
[diagram p7: Whitespace_Daughtercard_xceiver.SchDoc, bottom right]

### Parts
C68  0402  value 100pF  [0402_SMT_v3]
C81  0402  value 3.3pF  [0402_SMT_v3]
C82  0402  value 1.2pF  [0402_SMT_v3]
C83  0402  value 3.3pF  [0402_SMT_v3]
C84  0402  value 1.2pF  [0402_SMT_v3]
C85  0402  value 100pF  [0402_SMT_V3]
C86  0402  value 100pF  [0402_SMT_V3]
C87  0402  value 100pF  [0402_SMT_V3]
C88  0402 X7R 10%  value 0.1uF  [0402_SMT_V3]
C89  value 22pF  Supplier Part Number 1: 81-GRM1555C1H220GA1D  [0402_SMT_v3]  (hidden comment: 0402)
C90  value 1200pF  Supplier Part Number 1: 80-C0402C122K4G  [0402_SMT_v3]  (hidden comment: 0402)
C91  value 47pF  Supplier Part Number 1: 77-VJ0402A470FXACBC  [0402_SMT_v3]  (hidden comment: 0402)
C92  value 22pF  Supplier Part Number 1: 81-GRM1555C1H220GA1D  [0402_SMT_v3]  (hidden comment: 0402)
C93  value 1200pF  Supplier Part Number 1: 80-C0402C122K4G  [0402_SMT_v3]  (hidden comment: 0402)
C94  value 47pF  Supplier Part Number 1: 77-VJ0402A470FXACBC  [0402_SMT_v3]  (hidden comment: 0402)
C115  0402  value 100pF  [0402_SMT_v3]
C116  0402  value 100pF  [0402_SMT_v3]
C117  0402  value 100pF  [0402_SMT_v3]
C118  0402  value 100pF  [0402_SMT_v3]
C119  0402  value 100pF  [0402_SMT_v3]
C120  0402  value 100pF  [0402_SMT_v3]
C127  0402  value 100pF  [0402_SMT_v3]
C128  0402  value 100pF  [0402_SMT_v3]
D10  0.2pF 5.3V 20kV 40/5A  [TSLP-2-17]
D11  0.2pF 5.3V 20kV 40/5A  [TSLP-2-17]
D12  0.2pF 5.3V 20kV 40/5A  [TSLP-2-17]
D13  0.2pF 5.3V 20kV 40/5A  [TSLP-2-17]
D14  0.2pF 5.3V 20kV 40/5A  [TSLP-2-17]
J4  F_PCB_FEMALE_RT_ANGLE  [F_RT_ANGLE_PCB_FEMALE_5-1634540-1]
J5  F_PCB_FEMALE_RT_ANGLE  [F_RT_ANGLE_PCB_FEMALE_5-1634540-1]
J6  SMA_THRU_RT_ANGLE  Supplier Part Number 1: 538-73391-0080  [SMA_PCB_RtAngle_Female_MolexSD-73391-008_v4]
J7  SMA_THRU_RT_ANGLE  Supplier Part Number 1: 538-73391-0080  [SMA_PCB_RtAngle_Female_MolexSD-73391-008_v4]
J8  SMA_THRU_RT_ANGLE  Supplier Part Number 1: 538-73391-0080  [SMA_PCB_RtAngle_Female_MolexSD-73391-008_v4]
J9  Header 5X2A  [HDR2X5_CEN]
L12  0402  value 6.8nH  [0402_SMT_v3]
L13  0402  value 12nH  [0402_SMT_v3]
L14  0402  value 6.8nH  [0402_SMT_v3]
L15  0402  value 12nH  [0402_SMT_v3]
R12  0402  value 47  Supplier Part Number 1: 652-CR0402-JW-470GLF  [0402_SMT_v3]
R16  10kOhm Array  [741X083_ChipArray_0402x4_v2]
R17  10kOhm Array  [741X083_ChipArray_0402x4_v2]
R18  22 Ohm Array  [741X083_ChipArray_0402x4_v2]
R19  22 Ohm Array  [741X083_ChipArray_0402x4_v2]
R20  22 Ohm Array  [741X083_ChipArray_0402x4_v2]
R21  22 Ohm Array  [741X083_ChipArray_0402x4_v2]
R22  22 Ohm Array  [741X083_ChipArray_0402x4_v2]
R23  22 Ohm Array  [741X083_ChipArray_0402x4_v2]
R24  22 Ohm Array  [741X083_ChipArray_0402x4_v2]
R25  0402  value 47  [0402_SMT_v3]
R26  47 Ohm Array  [741X083_ChipArray_0402x4_v2]
R27  0402 1%  value 6.8k  [0402_SMT_v3]
R28  0402 1%  value 390  [0402_SMT_v3]
R29  0402 1%  value 12k  [0402_SMT_v3]
R30  0402  value 2.2k  Supplier Part Number 1: 660-RK73H1ETTP2201F  [0402_SMT_v3]
R31  0402  value 1.5k  Supplier Part Number 1: 660-RK73H1ETTP1501F  [0402_SMT_v3]
R32  0402  value 2.2k  Supplier Part Number 1: 660-RK73H1ETTP2201F  [0402_SMT_v3]
R33  0402  value 1.5k  Supplier Part Number 1: 660-RK73H1ETTP1501F  [0402_SMT_v3]
R36  0402  value 0  [0402_SMT_v3]
R41  47 Ohm Array  [741X083_ChipArray_0402x4_v2]
S1  BMIS-205  [BMIS-205]
S2  BMIS-205  [BMIS-205]
T5  TC4-25X+  [AT224-1_V2]
U1  LMS6002  Supplier Part Number 1: 1434-1000-1-ND  [LMS6002D_VIAOFFPAD_v2_Window]  (parts B,C,D of 4)

### Sub-sheets
UHF_RF_FRONT_END = Whitespace_Daughtercard_uhf.SchDoc: UHF_PA2_CTRL (in), UHF_TX_1 (bidir), UHF_TX_2 (bidir), UHF_ANT_CTRL (in), UHF_PA1_CTRL (in), UHF_BB_TX_p (in), UHF_BB_TX_n (in), UHF_BB_RX_p (out), UHF_BB_RX_n (out), UHF_BB_RX_EXTLNA_p (out), UHF_BB_RX_EXTLNA_n (out), UHF_LNA_CTRL (in)
WIFI_RF_FRONT_END = Whitespace_Daughtercard_wifi.SchDoc: WIFI_TXPWR_DET (out), WIFI_TX_2, WIFI_TX_1, WIFI_BB_TX_p, WIFI_BB_RX_p, WIFI_BB_RX_n, WIFI_BB_TX_n, WIFI_ANT_CTRL (in), WIFI_PA_CTRL (in)

### Ports
LIME_SPI (harness SSI), PLL_CLK_OUT, PLLCLK (in), RX_CLK_OUT, RX_DATA (harness RX_DIG_DATA), TRX_RESET (in), TX_DATA (harness TX_DIG_DATA), UHF_ANT_CTRL (in), UHF_LNA_CTRL (in), UHF_PA1_CTRL (in), UHF_PA2_CTRL (in), V_WIFI_TX (out), WIFI_ANT_CTRL (in), WIFI_PA_CTRL (in)

### Harnesses
TX_DIG_DATA: TXEN, TX_CLK, TX_IQ_SEL, TXD0, TXD1, TXD2, TXD3, TXD4, TXD5, TXD6, TXD7, TXD8, TXD9, TXD10, TXD11
RX_DIG_DATA: RXEN, RX_CLK, RX_IQ_SEL, RXD0, RXD2, RXD3, RXD4, RXD5, RXD6, RXD7, RXD8, RXD9, RXD10, RXD11, RXD1
SSI: Fss, Clk, Tx, Rx

### Nets
GND: C68.2 C81.1 C82.1 C83.1 C84.1 C88.1 C89.1 C91.1 C92.1 C94.1 C115.2 C116.2 C117.2 C118.2 C119.2 C120.2 C127.2 C128.2 D10.1 D11.1 D12.1 D13.1 D14.1 J4.GND J5.GND J6.GND J7.GND J8.GND J9.5 J9.10 R12.1 R16.8 R17.1 R17.2 R17.3 R17.4 R28.1 R29.2 R31.1 R33.1 R41.1 R41.2 R41.3 R41.4 S1.GND S2.GND T5.2(S_CT) T5.4(P) U1.53(UNUSED) U1.55(UNUSED) U1.88(UNUSED) U1.91(OEXLNA1P) U1.93(UNUSED) U1.95(OEXLNA1N) U1.97(RXIN1EP) U1.99(RXIN1EN)
VCC_3.3V: C68.1 C115.1 C116.1 C117.1 C118.1 C119.1 C120.1 C127.1 C128.1 R16.2 R16.3 R16.4
LMS_SCLK: R26.8 U1.70(SCLK)  [project net LMS_SCLK_4]
LMS_SDIO: R26.6 U1.69(SDIO)  [project net LMS_SDIO_4]
LMS_SDO: R26.7 U1.68(SDO)  [project net LMS_SDO_4]
LMS_SEN: R26.5 U1.67(SEN)  [project net LMS_SEN_4]
MASTER_CLK: R26.1 ; port LIME_SPI.Clk
MASTER_FSS: R26.4 ; port LIME_SPI.Fss
MASTER_RX: R26.2 ; port LIME_SPI.Rx
MASTER_TX: R26.3 ; port LIME_SPI.Tx
PB5: port UHF_LNA_CTRL, sheet UHF_RF_FRONT_END/UHF_LNA_CTRL
PD2: port V_WIFI_TX, sheet WIFI_RF_FRONT_END/WIFI_TXPWR_DET
PE4: R17.5 ; port UHF_PA1_CTRL, sheet UHF_RF_FRONT_END/UHF_PA1_CTRL
PLL_CLK_OUT: U1.41(PLLCLKOUT) ; port PLL_CLK_OUT
PLLCLK: R12.2 R36.2 ; port PLLCLK
RX3_N: C85.2 U1.110(RXIN3N)  [project net RX3_N_4]
RX3_P: C87.2 U1.108(RXIN3P)  [project net RX3_P_4]
RX_CLK: R21.3 ; port RX_DATA.RX_CLK
RX_CLK_IN: R21.6 U1.17(RX_CLK)  [project net RX_CLK_IN_4]
RX_CLK_OUT: U1.40(RX_CLK_OUT) ; port RX_CLK_OUT
RX_EN: R16.7 U1.76(RXEN) ; port RX_DATA.RXEN
RX_IQ_SEL: R21.4 ; port RX_DATA.RX_IQ_SEL
RX_IQ_SEL_IN: R21.5 U1.16(RX_IQ_SEL)  [project net RX_IQ_SEL_IN_4]
RXCPOUT: C90.2 C91.2 R30.2 U1.80(RXCPOUT)  [project net RXCPOUT_4]
RXD0: R22.1 ; port RX_DATA.RXD0
RXD1: R22.2 ; port RX_DATA.RXD1
RXD2: R22.3 ; port RX_DATA.RXD2
RXD3: R23.1 ; port RX_DATA.RXD3
RXD4: R22.4 ; port RX_DATA.RXD4
RXD5: R23.3 ; port RX_DATA.RXD5
RXD6: R23.2 ; port RX_DATA.RXD6
RXD7: R23.4 ; port RX_DATA.RXD7
RXD8: R24.1 ; port RX_DATA.RXD8
RXD9: R24.2 ; port RX_DATA.RXD9
RXD10: R24.3 ; port RX_DATA.RXD10
RXD11: R24.4 ; port RX_DATA.RXD11
RXOUTIN: J9.8 U1.115(RXOUTIN)  [project net RXOUTIN_4]
RXOUTIP: J9.3 U1.116(RXOUTIP)  [project net RXOUTIP_4]
RXOUTQN: J9.9 U1.114(RXOUTQN)  [project net RXOUTQN_4]
RXOUTQP: J9.4 U1.113(RXOUTQP)  [project net RXOUTQP_4]
RXVTUNE: C89.2 R30.1 U1.87(RXVTUNE)  [project net RXVTUNE_4]
TRX_RESET: R25.2 ; port TRX_RESET
TRX_RESET: R16.6 R25.1 U1.75(RESET)  [project net TRX_RESET_4]  [a separate net that carries the same name]
TSTD1: U1.65(TSTD_OUT1)  [project net TSTD1_4]
TSTD2: U1.77(TSTD_OUT2)  [project net TSTD2_4]
TX_CLK: R21.1 ; port TX_DATA.TX_CLK
TX_CLK_IN: R21.8 U1.19(TX_CLK)  [project net TX_CLK_IN_4]
TX_EN: R16.5 U1.66(TXEN) ; port TX_DATA.TXEN
TX_IQ_SEL: R21.2 ; port TX_DATA.TX_IQ_SEL
TX_IQ_SEL_IN: R21.7 U1.20(TX_IQ_SEL)  [project net TX_IQ_SEL_IN_4]
TXCPOUT: C93.2 C94.2 R32.2 U1.64(TXCPOUT)  [project net TXCPOUT_4]
TXD0: R18.4 ; port TX_DATA.TXD0
TXD1: R18.3 ; port TX_DATA.TXD1
TXD2: R18.2 ; port TX_DATA.TXD2
TXD3: R18.1 ; port TX_DATA.TXD3
TXD4: R19.4 ; port TX_DATA.TXD4
TXD5: R19.3 ; port TX_DATA.TXD5
TXD6: R19.2 ; port TX_DATA.TXD6
TXD7: R19.1 ; port TX_DATA.TXD7
TXD8: R20.4 ; port TX_DATA.TXD8
TXD9: R20.2 ; port TX_DATA.TXD9
TXD10: R20.3 ; port TX_DATA.TXD10
TXD11: R20.1 ; port TX_DATA.TXD11
TXININ: J9.6 R41.8 U1.51(TXININ)  [project net TXININ_4]
TXINIP: J9.1 R41.6 U1.52(TXINIP)  [project net TXINIP_4]
TXINQN: J9.7 R41.5 U1.56(TXINQN)  [project net TXINQN_4]
TXINQP: J9.2 R41.7 U1.54(TXINQP)  [project net TXINQP_4]
TXVTUNE: C92.2 R32.1 U1.57(TXVTUNE)  [project net TXVTUNE_4]
UHF_ANT_1: L12.1 ; sheet UHF_RF_FRONT_END/UHF_TX_1
UHF_ANT_2: L14.1 ; sheet UHF_RF_FRONT_END/UHF_TX_2
UHF_ANT_CTRL: R16.1 ; port UHF_ANT_CTRL, sheet UHF_RF_FRONT_END/UHF_ANT_CTRL
UHF_BB_RX_n: U1.98(RXIN1N) ; sheet UHF_RF_FRONT_END/UHF_BB_RX_n
UHF_BB_RX_p: U1.96(RXIN1P) ; sheet UHF_RF_FRONT_END/UHF_BB_RX_p
UHF_BB_TX_n: U1.50(TXOUT1N) ; sheet UHF_RF_FRONT_END/UHF_BB_TX_n
UHF_BB_TX_p: U1.48(TXOUT1P) ; sheet UHF_RF_FRONT_END/UHF_BB_TX_p
UHF_PA2_CTRL: R17.6 ; port UHF_PA2_CTRL, sheet UHF_RF_FRONT_END/UHF_PA2_CTRL
UHF_POSTEXTLNA_n: U1.94(IEXMIX1N) ; sheet UHF_RF_FRONT_END/UHF_BB_RX_EXTLNA_n
UHF_POSTEXTLNA_p: U1.92(IEXMIX1P) ; sheet UHF_RF_FRONT_END/UHF_BB_RX_EXTLNA_p
VREFAD: C88.2 U1.38(VREFAD)  [project net VREFAD_4]
WIFI_ANT_1: D12.2 J6.1(Signal) ; sheet WIFI_RF_FRONT_END/WIFI_TX_1
WIFI_ANT_2: D13.2 J7.1(Signal) ; sheet WIFI_RF_FRONT_END/WIFI_TX_2
WIFI_ANT_CTRL: R17.7 ; port WIFI_ANT_CTRL, sheet WIFI_RF_FRONT_END/WIFI_ANT_CTRL
WIFI_BB_RX_N: U1.102(RXIN2N) ; sheet WIFI_RF_FRONT_END/WIFI_BB_RX_n
WIFI_BB_RX_P: U1.100(RXIN2P) ; sheet WIFI_RF_FRONT_END/WIFI_BB_RX_p
WIFI_BB_TX_N: U1.46(TXOUT2P) ; sheet WIFI_RF_FRONT_END/WIFI_BB_TX_n
WIFI_BB_TX_P: U1.44(TXOUT2N) ; sheet WIFI_RF_FRONT_END/WIFI_BB_TX_p
WIFI_PA_CTRL: R17.8 ; port WIFI_PA_CTRL, sheet WIFI_RF_FRONT_END/WIFI_PA_CTRL
XRES12K: R29.1 U1.89(XRES12K)  [project net XRES12K_4]
XRESAD: R27.2 U1.39(XRESAD)  [project net XRESAD_4]
NetC81_2: C81.2 L12.2 L13.1
NetC82_2: C82.2 D10.2 J4.1(Signal) L13.2
NetC83_2: C83.2 L14.2 L15.1
NetC84_2: C84.2 D11.2 J5.1(Signal) L15.2
NetC85_1: C85.1 T5.3(S_DOT)
NetC86_1: C86.1 D14.2 J8.1(Signal)
NetC86_2: C86.2 T5.6(P_DOT)
NetC87_1: C87.1 T5.1(S)
NetC90_1: C90.1 R31.2
NetC93_1: C93.1 R33.2
NetR18_5: R18.5 U1.21(TXD0)
NetR18_6: R18.6 U1.22(TXD1)
NetR18_7: R18.7 U1.23(TXD2)
NetR18_8: R18.8 U1.24(TXD3)
NetR19_5: R19.5 U1.25(TXD4)
NetR19_6: R19.6 U1.26(TXD5)
NetR19_7: R19.7 U1.27(TXD6)
NetR19_8: R19.8 U1.28(TXD7)
NetR20_5: R20.5 U1.29(TXD8)
NetR20_6: R20.6 U1.31(TXD10)
NetR20_7: R20.7 U1.30(TXD9)
NetR20_8: R20.8 U1.32(TXD11)
NetR22_5: R22.5 U1.11(RXD4)
NetR22_6: R22.6 U1.13(RXD2)
NetR22_7: R22.7 U1.14(RXD1)
NetR22_8: R22.8 U1.15(RXD0)
NetR23_5: R23.5 U1.6(RXD7)
NetR23_6: R23.6 U1.8(RXD5)
NetR23_7: R23.7 U1.9(RXD6)
NetR23_8: R23.8 U1.10(RXD3)
NetR24_5: R24.5 U1.2(RXD11)
NetR24_6: R24.6 U1.3(RXD10)
NetR24_7: R24.7 U1.4(RXD9)
NetR24_8: R24.8 U1.5(RXD8)
NetR27_1: R27.1 R28.2
NetR36_1: R36.1 U1.71(PLLCLK)
NetU1_103: U1.103(OEXLNA2P) U1.104(IEXMIX2P)
NetU1_105: U1.105(OEXLNA2N) U1.106(IEXMIX2N)

Not connected (* = marked no-connect by the designer): U1 42(ATP)

### Layout directives
rule Impedance Constraint [Min = 49.00    Max = 51.00    ]; net class RF: NetC81_2, NetC82_2, NetC83_2, NetC84_2, NetC85_1, NetC86_1, NetC86_2, NetC87_1, RX3_N_4, RX3_P_4, RXCPOUT_4, RXOUTIN_4, RXOUTIP_4, RXOUTQN_4, RXOUTQP_4, RXVTUNE_4, TXCPOUT_4, TXININ_4, TXINIP_4, TXINQN_4, TXINQP_4, TXVTUNE_4, UHF_ANT_1, UHF_ANT_2, WIFI_ANT_1, WIFI_ANT_2
rule Impedance Constraint [Min = 32.00    Max = 33.00    ]; net class RF_325: UHF_BB_RX_n, UHF_BB_RX_p, UHF_BB_TX_n, UHF_BB_TX_p, UHF_POSTEXTLNA_n, UHF_POSTEXTLNA_p, WIFI_BB_RX_N, WIFI_BB_RX_P, WIFI_BB_TX_N, WIFI_BB_TX_P
rule Impedance Constraint [Min = 49.00    Max = 51.00    ]; net class CLK: NetR36_1, PLL_CLK_OUT, PLLCLK, RX_CLK, RX_CLK_IN_4, RX_CLK_OUT, TX_CLK, TX_CLK_IN_4
differential pair: RX3_N_4, RX3_P_4

### Notes on the sheet
- (near C68) The bank of capacitors between VCC_3.3V and GND are meant to serev as current return paths for the digital I/O baseband signals when they shift reference plane from the top to the bottom of the board. they should be placed near these transition points.
  The 100pF value has been chosen since it has lowest impedance precisely at the line speed of around 40 MHz.
- Default states due to pulldowns & pullups:
  1. WiFi PA is in POWERDOWN.
  2. UHF PA1's VCC supply is OFF.
  3. UHF PA2's VBIAS in at 0 V; IBIAS is zero.
  4. WiFi ANT1 is TX.
  5. UHF ANT1 is TX.
  6. Lime Transceiver is in RESET.
  7. Lime Transceiver TX and RX is ENABLED.
- Termination resistor for RF reference clock line.
  Jumper supplied to tune the series resistor of the clock just in case.
- 1. Note that the line just before the F-Type connector should be 75 Ohm for matching. However, 75 Ohm stripline would be WAY too narrow to carry the expected current in this output line. Thus, the layout of this part pushes the inductor as close to the connector's center pin as possible and places a very short 50 Ohm trace down.
- Jumper supplied to tune the series resistor of the clock just in case.
- (near R18) This dumb-looking wiring for TXD actually helps with layout. :/
- (near R21) 1. This arrangement makes sense given HSMC connector layout, and it keeps the TX/RX clocks far apart to prevent coupling.
- 1. Each UHF output is matched to a 75-Ohm antenna F-type connector.
  2. ALWAYS terminate or connect the RF output lines to prevent damage to the PAs.
  3. Note that the WiFi TX RF chain is completely optional for production.
  4. RXIN3 has been placed for the research version of the card in order to present a broadband input for applications not envisioned yet, like spectrum scanning, etc...
- 1. This extra broadband input is populated only for the research version of this board.
- 1. Analog baseband signals can be piped in via 1.27mm headers.
- (near R25) RESET is pulled high so transceiver starts ON.
  RESET is active-low. Low = XCeiver in Reset.
  The series resistor comes from the Lime Ref15 design.
- 1. Note that since the LMS6002D is SSI slave, RX/TX directions are determined by the HOST/MASTER
  2. The strange order at the series res array is due to layout.
- 1. RX_CLK_OUT and PLL_CLK_OUT are provided for baseband synchronization.
- 1. RX/TX PLL loop filters are copied from Lime's Ref15 design, as recommended.
- (near R41) Again, dumb-looking connections are due to layout considerations.
- of
- (in symbol BMIS-205) 1.0 x 1.5 x 0.236 in
- (in symbol F_PCB_FEMALE_RT_ANGLE) F-Type; 75 Ohm
- (in symbol LMS6002, part B) LMS6002D
- (in symbol LMS6002, part C) LMS6002D
- (in symbol LMS6002, part D) LMS6002D
- (in symbol SMA_PCB_RT_ANGLE) SMA; 50 Ohm
- (in symbol TC4-25X+) .; 4 : 1

### Library data of the parts
C68 C81-C84 C115-C120 C127 C128 = Cap Semi: Capacitor (Semiconductor SIM Model); Published: 8-Jun-2000; LatestRevisionDate: 29-May-2009; LatestRevisionNote: IPC-7351 Footprint Added.; PackageReference: C1206; Publisher: Altium Limited; PackageDescription: Chip Capacitor; Supplier 1: Mouser
  C68 C115-C120 C127 C128: Supplier Part Number 1: 81-GRM1555C1H101GA1D
  C81 C83: Supplier Part Number 1: 81-GRM1555C1H3R3WA1D
  C82 C84: Supplier Part Number 1: 81-GRM1555C1H1R2WA1D
C85-C88 = Cap: Capacitor; Published: 8-Jun-2000; LatestRevisionDate: 17-Jul-2002; LatestRevisionNote: Re-released for DXP Platform.; PackageReference: RAD-0.3; Publisher: Altium Limited; PackageDescription: Radial Cap, Thru-Hole; 2 Leads; 0.3 in Pin Spacing; Supplier 1: Mouser
  C85-C87: Supplier Part Number 1: 81-GRM1555C1H101GA1D
  C88: Supplier Part Number 1: 810-C1005X7R1H104K
C89-C94 = Cap_0402: 0402 SMT Cap; Supplier 1: Mouser
D10-D14 = ESD0P2RF-02LRH: Bidirectional TVS Diode for RF Protection - Infineon; Supplier 1: Mouser; Supplier Part Number 1: 726-ESD0P2RF02LRH726
J4 J5 = F_PCB_FEMALE_RT_ANGLE: Right-Angle Through-PCB Female F-Type Connector, TE Connectivity, 75 Ohm; Supplier 1: Mouser; Supplier Part Number 1: 571-5-1634540-1
J6-J8 = SMA_PCB_RT_ANGLE: SMA 50 Ohm Female-NP Through Mount, Right-Angle Connector; Supplier 1: Mouser
J9 = Header 5X2A: Header, 5-Pin, Dual row; LatestRevisionDate: 17-Jul-2002; LatestRevisionNote: Re-released for DXP Platform.; Publisher: Altium Limited
L12-L15 = Inductor: Code_IEC: 1005; Published: 8-Jun-2000; LatestRevisionDate: 29-May-2009; LatestRevisionNote: IPC-7351 Footprint Added.; PackageReference: 0402-A; Publisher: Altium Limited; PackageDescription: Chip Inductor; Code_JEITA: 0402; Supplier 1: Mouser
  L12 L14: Supplier Part Number 1: 81-LQP15MN6N8B02D
  L13 L15: Supplier Part Number 1: 81-LQP15MN12NG02D
R12 R25 R27-R29 = Res Semi: Semiconductor Resistor; Published: 8-Jun-2000; LatestRevisionDate: 17-Jul-2002; LatestRevisionNote: Re-released for DXP Platform.; PackageReference: AXIAL-0.5; Publisher: Altium Limited; PackageDescription: Axial Device, Thru-Hole; 2 Leads; 0.5 in Pin Spacing; Supplier 1: Mouser
  R25: Supplier Part Number 1: 667-ERJ-2GEJ470X
  R27: Supplier Part Number 1: 667-ERJ-2RKF6801X
  R28: Supplier Part Number 1: 667-ERJ-2RKF3900X
  R29: Supplier Part Number 1: 667-ERJ-2RKF1202X
R16 R17 = 741X083103JP: 10kOhm Ohm 4x0402 Resistor Array; Supplier 1: Mouser; Supplier Part Number 1: 774-741X083103JP
R18-R24 = 741X083220JP: 22 Ohm 4x0402 Resistor Array; Supplier 1: Mouser; Supplier Part Number 1: 774-741X083220JP
R26 R41 = 741X083470JP: 47 Ohm 4x0402 Resistor Array; Supplier 1: Mouser; Supplier Part Number 1: 774-741X083470JP
R30-R33 = Res_0402: 0402 SMT Resistor; Supplier 1: Mouser
R36 = Res3: Resistor; Published: 8-Jun-2000; LatestRevisionDate: 29-May-2009; LatestRevisionNote: IPC-7351 Footprint Added.; PackageReference: J1-0603; Publisher: Altium Limited; PackageDescription: Chip Resistor; Supplier 1: Mouser; Supplier Part Number 1: 660-RK73Z1ETTP
S1 S2 = BMIS-205: EMI Shield 1.0 x 1.5 x 0.236 LairdTech; Supplier 1: Mouser; Supplier Part Number 1: 739-BMIS-205-F
T5 = TC4-25X+: Mini-Circuits Type A Transformer, 4:1 Ohm, CT, 500-2500MHz
U1 = LMS6002: as U1 on sheet Whitespace_Daughtercard_pwr; Supplier 1: Digi-Key